# EAGLE design ACT Lipoly Charger R3 FINAL (EAGLE 8.2.2)
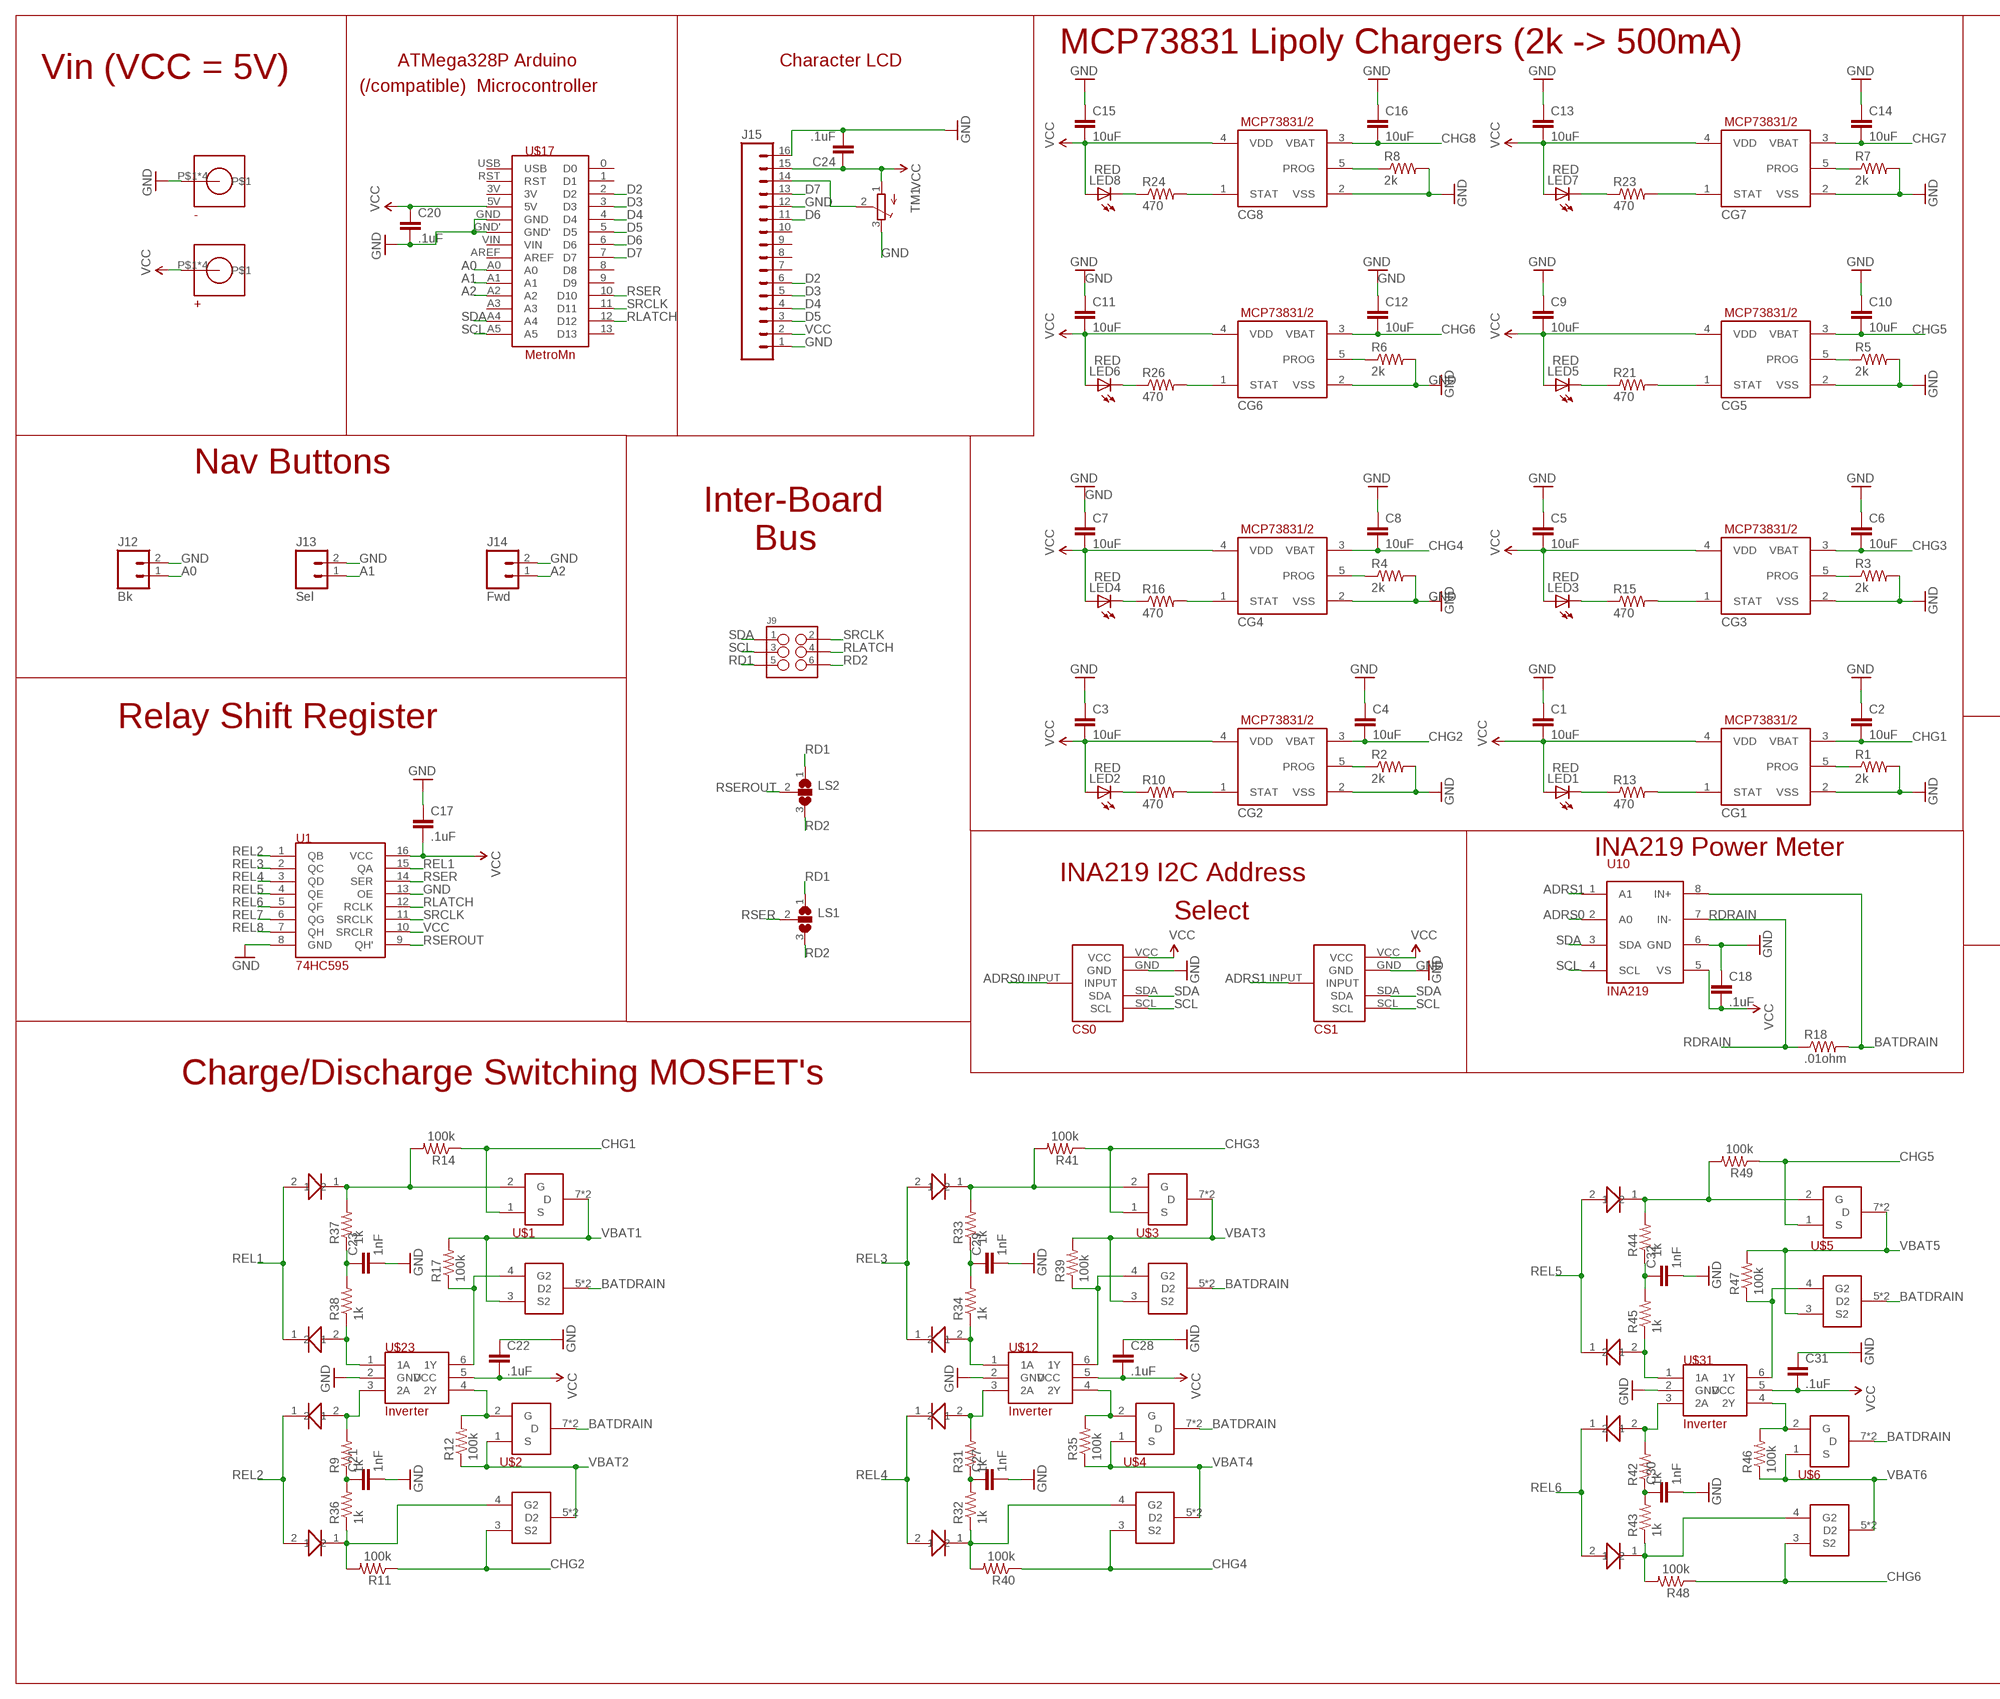
[diagram p0: schematic, sheet 1, part 1 of 2]
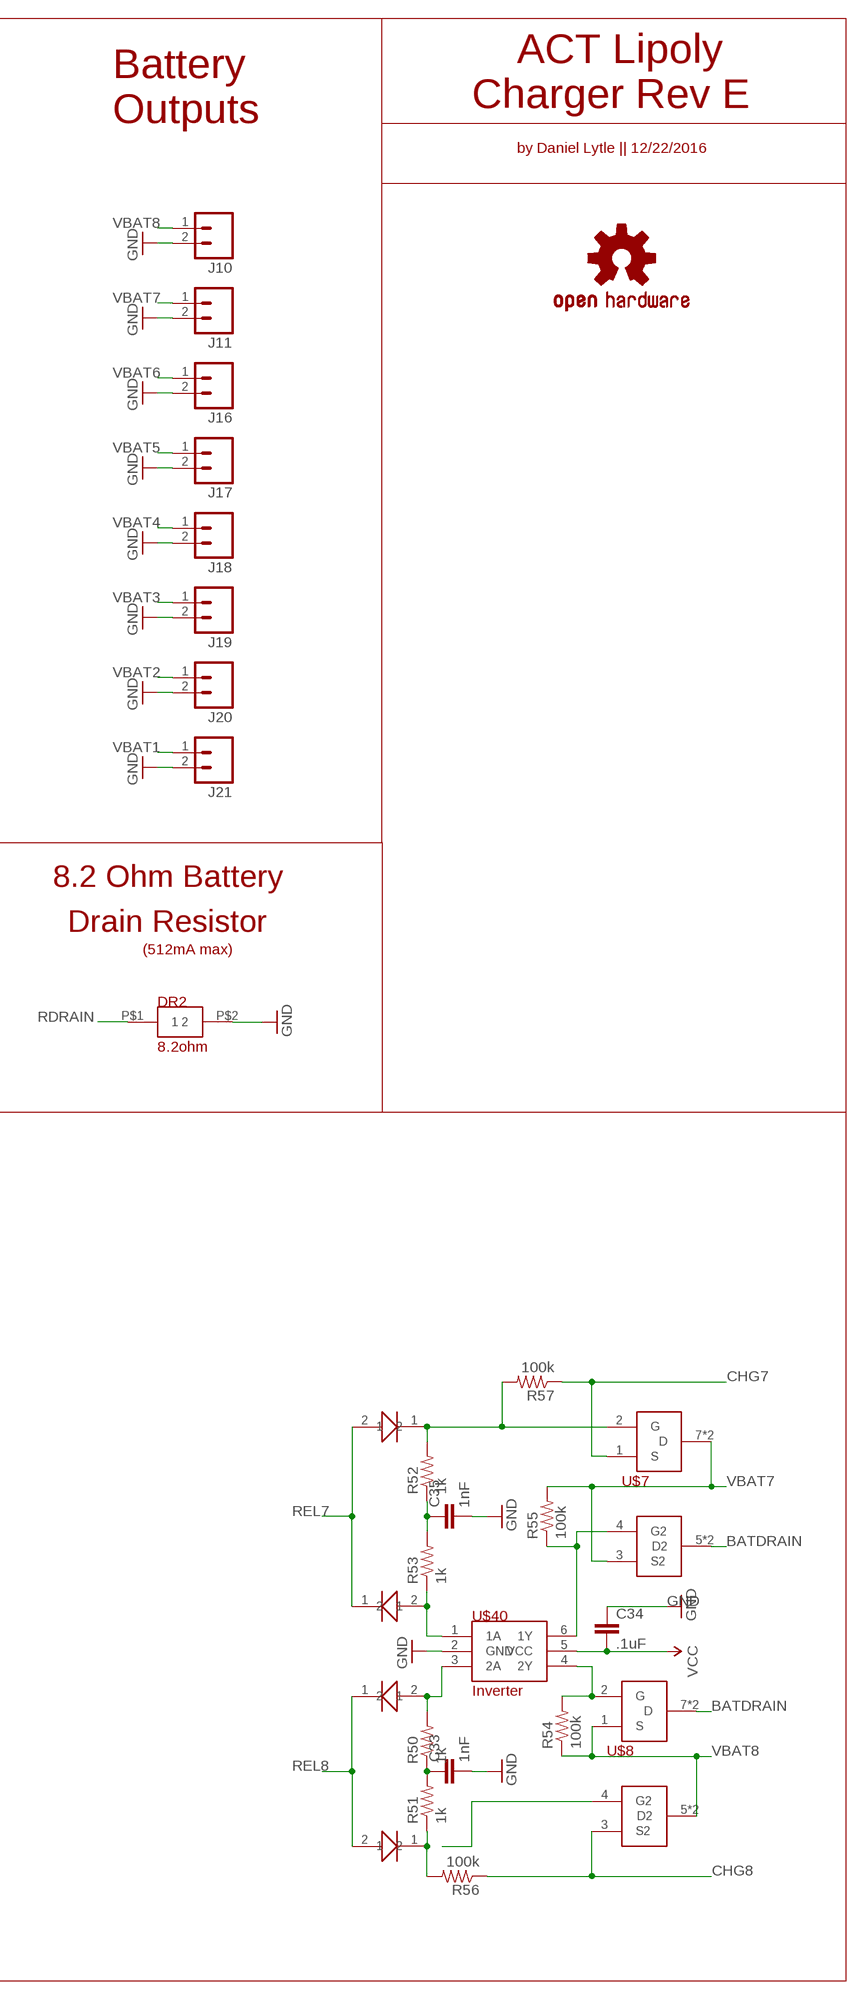
[diagram p1: schematic, sheet 1, part 2 of 2]

## Parts
+  8191-SEMS  [9191-SEMS]
-  8191-SEMS  [9191-SEMS]
C1  10uF  CAP0805  [0805]
C2  10uF  CAP0805  [0805]
C3  10uF  CAP0805  [0805]
C4  10uF  CAP0805  [0805]
C5  10uF  CAP0805  [0805]
C6  10uF  CAP0805  [0805]
C7  10uF  CAP0805  [0805]
C8  10uF  CAP0805  [0805]
C9  10uF  CAP0805  [0805]
C10  10uF  CAP0805  [0805]
C11  10uF  CAP0805  [0805]
C12  10uF  CAP0805  [0805]
C13  10uF  CAP0805  [0805]
C14  10uF  CAP0805  [0805]
C15  10uF  CAP0805  [0805]
C16  10uF  CAP0805  [0805]
C17  .1uF  CAP0805  [0805]
C18  .1uF  CAP0805  [0805]
C20  .1uF  CAP0805  [0805]
C21  1nF  CAP0805  [0805]
C22  .1uF  CAP0805  [0805]
C23  1nF  CAP0805  [0805]
C24  .1uF  CAP0805  [0805]
C27  1nF  CAP0805  [0805]
C28  .1uF  CAP0805  [0805]
C29  1nF  CAP0805  [0805]
C30  1nF  CAP0805  [0805]
C31  .1uF  CAP0805  [0805]
C32  1nF  CAP0805  [0805]
C33  1nF  CAP0805  [0805]
C34  .1uF  CAP0805  [0805]
C35  1nF  CAP0805  [0805]
CG1  MCP73831/OT  [SOT23-5L]
CG2  MCP73831/OT  [SOT23-5L]
CG3  MCP73831/OT  [SOT23-5L]
CG4  MCP73831/OT  [SOT23-5L]
CG5  MCP73831/OT  [SOT23-5L]
CG6  MCP73831/OT  [SOT23-5L]
CG7  MCP73831/OT  [SOT23-5L]
CG8  MCP73831/OT  [SOT23-5L]
CS0  4-WAYSELECTOR  [4-WAYSELECTOR]
CS1  4-WAYSELECTOR  [4-WAYSELECTOR]
DR2  8.2ohm  UB5C-5R6F1  [UB5C-5R6F1]
J9  M03X2FEMALE  [2X3]
J10  M02LOCK_LONGPADS  [1X02_LOCK_LONGPADS]
J11  M02LOCK_LONGPADS  [1X02_LOCK_LONGPADS]
J12  Bk  M02LOCK_LONGPADS  [1X02_LOCK_LONGPADS]
J13  Sel  M02LOCK_LONGPADS  [1X02_LOCK_LONGPADS]
J14  Fwd  M02LOCK_LONGPADS  [1X02_LOCK_LONGPADS]
J15  M16LOCK_LONGPADS  [1X16_LOCK_LONGPADS]
J16  M02LOCK_LONGPADS  [1X02_LOCK_LONGPADS]
J17  M02LOCK_LONGPADS  [1X02_LOCK_LONGPADS]
J18  M02LOCK_LONGPADS  [1X02_LOCK_LONGPADS]
J19  M02LOCK_LONGPADS  [1X02_LOCK_LONGPADS]
J20  M02LOCK_LONGPADS  [1X02_LOCK_LONGPADS]
J21  M02LOCK_LONGPADS  [1X02_LOCK_LONGPADS]
LED1  RED  LEDCHIP-LED0805  [CHIP-LED0805]
LED2  RED  LEDCHIP-LED0805  [CHIP-LED0805]
LED3  RED  LEDCHIP-LED0805  [CHIP-LED0805]
LED4  RED  LEDCHIP-LED0805  [CHIP-LED0805]
LED5  RED  LEDCHIP-LED0805  [CHIP-LED0805]
LED6  RED  LEDCHIP-LED0805  [CHIP-LED0805]
LED7  RED  LEDCHIP-LED0805  [CHIP-LED0805]
LED8  RED  LEDCHIP-LED0805  [CHIP-LED0805]
LS1  SJ2W  [SJ_2]
LS2  SJ2W  [SJ_2]
R1  2k  RESISTOR0805-RES  [0805]
R2  2k  RESISTOR0805-RES  [0805]
R3  2k  RESISTOR0805-RES  [0805]
R4  2k  RESISTOR0805-RES  [0805]
R5  2k  RESISTOR0805-RES  [0805]
R6  2k  RESISTOR0805-RES  [0805]
R7  2k  RESISTOR0805-RES  [0805]
R8  2k  RESISTOR0805-RES  [0805]
R9  1k  RESISTOR0805-RES  [0805]
R10  470  RESISTOR0805-RES  [0805]
R11  100k  RESISTOR0805-RES  [0805]
R12  100k  RESISTOR0805-RES  [0805]
R13  470  RESISTOR0805-RES  [0805]
R14  100k  RESISTOR0805-RES  [0805]
R15  470  RESISTOR0805-RES  [0805]
R16  470  RESISTOR0805-RES  [0805]
R17  100k  RESISTOR0805-RES  [0805]
R18  .01ohm  RESISTOR0805-RES  [0805]
R21  470  RESISTOR0805-RES  [0805]
R23  470  RESISTOR0805-RES  [0805]
R24  470  RESISTOR0805-RES  [0805]
R26  470  RESISTOR0805-RES  [0805]
R31  1k  RESISTOR0805-RES  [0805]
R32  1k  RESISTOR0805-RES  [0805]
R33  1k  RESISTOR0805-RES  [0805]
R34  1k  RESISTOR0805-RES  [0805]
R35  100k  RESISTOR0805-RES  [0805]
R36  1k  RESISTOR0805-RES  [0805]
R37  1k  RESISTOR0805-RES  [0805]
R38  1k  RESISTOR0805-RES  [0805]
R39  100k  RESISTOR0805-RES  [0805]
R40  100k  RESISTOR0805-RES  [0805]
R41  100k  RESISTOR0805-RES  [0805]
R42  1k  RESISTOR0805-RES  [0805]
R43  1k  RESISTOR0805-RES  [0805]
R44  1k  RESISTOR0805-RES  [0805]
R45  1k  RESISTOR0805-RES  [0805]
R46  100k  RESISTOR0805-RES  [0805]
R47  100k  RESISTOR0805-RES  [0805]
R48  100k  RESISTOR0805-RES  [0805]
R49  100k  RESISTOR0805-RES  [0805]
R50  1k  RESISTOR0805-RES  [0805]
R51  1k  RESISTOR0805-RES  [0805]
R52  1k  RESISTOR0805-RES  [0805]
R53  1k  RESISTOR0805-RES  [0805]
R54  100k  RESISTOR0805-RES  [0805]
R55  100k  RESISTOR0805-RES  [0805]
R56  100k  RESISTOR0805-RES  [0805]
R57  100k  RESISTOR0805-RES  [0805]
TM1  TRIMPOTTC33X  [TC33X]
U1  74HC595  [DIL16]
U10  INA219  [SOIC8]
U$1  DMP3085LSD  [SOIC8]
U$2  DMP3085LSD  [SOIC8]
U$3  DMP3085LSD  [SOIC8]
U$4  DMP3085LSD  [SOIC8]
U$5  DMP3085LSD  [SOIC8]
U$6  DMP3085LSD  [SOIC8]
U$7  DMP3085LSD  [SOIC8]
U$8  DMP3085LSD  [SOIC8]
U$12  Inverter  TC7PZ14FU,LJ(CT_INVERTER  [SOT363_PHILIPS]
U$15  DA2J10100L_DIODE  [SOD323]
U$16  DA2J10100L_DIODE  [SOD323]
U$17  MetroMn  ADAFRUIT_METRO_MINI  [ADAFRUIT_METRO_MINI]
U$18  DA2J10100L_DIODE  [SOD323]
U$19  DA2J10100L_DIODE  [SOD323]
U$23  Inverter  TC7PZ14FU,LJ(CT_INVERTER  [SOT363_PHILIPS]
U$26  DA2J10100L_DIODE  [SOD323]
U$27  DA2J10100L_DIODE  [SOD323]
U$28  DA2J10100L_DIODE  [SOD323]
U$29  DA2J10100L_DIODE  [SOD323]
U$31  Inverter  TC7PZ14FU,LJ(CT_INVERTER  [SOT363_PHILIPS]
U$34  DA2J10100L_DIODE  [SOD323]
U$35  DA2J10100L_DIODE  [SOD323]
U$36  DA2J10100L_DIODE  [SOD323]
U$37  DA2J10100L_DIODE  [SOD323]
U$40  Inverter  TC7PZ14FU,LJ(CT_INVERTER  [SOT363_PHILIPS]
U$43  DA2J10100L_DIODE  [SOD323]
U$44  DA2J10100L_DIODE  [SOD323]
U$45  DA2J10100L_DIODE  [SOD323]
U$46  DA2J10100L_DIODE  [SOD323]
VCC  OSHW-LOGOM-COPPER  [OSHW-LOGO-M_COPPER]

## Nets
A0: J12.1 U$17.A0
A1: J13.1 U$17.A1
A2: J14.1 U$17.A2
ADRS0: CS0.INPUT U10.2(A0)
ADRS1: CS1.INPUT U10.1(A1)
BATDRAIN: R18.2 U10.8(IN+) U$1.5(D2) U$1.6(D2) U$2.7(D) U$2.8(D) U$3.5(D2) U$3.6(D2) U$4.7(D) U$4.8(D) U$5.5(D2) U$5.6(D2) U$6.7(D) U$6.8(D) U$7.5(D2) U$7.6(D2) U$8.7(D) U$8.8(D)
CHG1: C2.2 CG1.3(VBAT) R14.1 U$1.1(S)
CHG2: C4.2 CG2.3(VBAT) R11.1 U$2.3(S2)
CHG3: C6.2 CG3.3(VBAT) R41.1 U$3.1(S)
CHG4: C8.2 CG4.3(VBAT) R40.1 U$4.3(S2)
CHG5: C10.2 CG5.3(VBAT) R49.1 U$5.1(S)
CHG6: C12.2 CG6.3(VBAT) R48.1 U$6.3(S2)
CHG7: C14.2 CG7.3(VBAT) R57.1 U$7.1(S)
CHG8: C16.2 CG8.3(VBAT) R56.1 U$8.3(S2)
D2: J15.6 U$17.2(D2)
D3: J15.5 U$17.3(D3)
D4: J15.4 U$17.4(D4)
D5: J15.3 U$17.5(D5)
D6: J15.11 U$17.6(D6)
D7: J15.13 U$17.7(D7)
GND: -.P$1 -.P$2 -.P$3 -.P$4 C1.1 C2.1 C3.1 C4.1 C5.1 C6.1 C7.1 C8.1 C9.1 C10.1 C11.1 C12.1 C13.1 C14.1 C15.1 C16.1 C17.1 C18.1 C20.2 C21.2 C22.1 C23.2 C24.2 C27.2 C28.1 C29.2 C30.2 C31.1 C32.2 C33.2 C34.1 C35.2 CG1.2(VSS) CG2.2(VSS) CG3.2(VSS) CG4.2(VSS) CG5.2(VSS) CG6.2(VSS) CG7.2(VSS) CG8.2(VSS) CS0.GND CS1.GND DR2.P$2 J10.2 J11.2 J12.2 J13.2 J14.2 J15.1 J15.12 J15.16 J16.2 J17.2 J18.2 J19.2 J20.2 J21.2 R1.2 R2.2 R3.2 R4.2 R5.2 R6.2 R7.2 R8.2 TM1.3(E) U1.8(GND) U1.13(OE) U10.6(GND) U$12.2(GND) U$17.GND U$17.GND' U$23.2(GND) U$31.2(GND) U$40.2(GND)
N$1: CG7.1(STAT) R23.2
N$2: CG8.5(PROG) R8.1
N$3: LED7.C R23.1
N$4: CG7.5(PROG) R7.1
N$5: CG6.5(PROG) R6.1
N$6: CG8.1(STAT) R24.2
N$7: CG5.5(PROG) R5.1
N$8: CG4.5(PROG) R4.1
N$9: LED8.C R24.1
N$10: CG3.5(PROG) R3.1
N$11: CG2.5(PROG) R2.1
N$12: LED6.C R26.1
N$13: CG1.5(PROG) R1.1
N$14: CG6.1(STAT) R26.2
N$15: CG4.1(STAT) R16.2
N$16: LED4.C R16.1
N$17: LED5.C R21.1
N$18: CG5.1(STAT) R21.2
N$19: LED3.C R15.1
N$20: CG3.1(STAT) R15.2
N$21: LED1.C R13.1
N$22: CG1.1(STAT) R13.2
N$23: CG2.1(STAT) R10.2
N$24: LED2.C R10.1
N$25: U$8.4(G2)
N$28: J15.14 TM1.2(S)
N$36: R38.1 U$23.1(1A) U$29.2
N$37: R9.2 U$23.3(2A) U$28.2
N$38: C21.1 R9.1 R36.2
N$39: R11.2 R36.1 U$2.4(G2) U$26.1
N$40: R12.2 U$2.2(G) U$23.4(2Y)
N$41: R17.1 U$1.4(G2) U$23.6(1Y)
N$42: C23.1 R37.1 R38.2
N$43: R14.2 R37.2 U$1.2(G) U$27.1
N$44: R31.2 U$12.3(2A) U$16.2
N$45: C27.1 R31.1 R32.2
N$46: R32.1 R40.2 U$4.4(G2) U$15.1
N$47: R35.2 U$4.2(G) U$12.4(2Y)
N$50: R34.1 U$12.1(1A) U$19.2
N$51: R39.1 U$3.4(G2) U$12.6(1Y)
N$52: R33.2 R41.2 U$3.2(G) U$18.1
N$54: C29.1 R33.1 R34.2
N$55: R42.2 U$31.3(2A) U$35.2
N$56: C30.1 R42.1 R43.2
N$57: R43.1 R48.2 U$6.4(G2) U$34.1
N$58: R46.2 U$6.2(G) U$31.4(2Y)
N$59: R45.1 U$31.1(1A) U$37.2
N$60: R47.1 U$5.4(G2) U$31.6(1Y)
N$61: R44.2 R49.2 U$5.2(G) U$36.1
N$62: C32.1 R44.1 R45.2
N$63: R50.2 U$40.3(2A) U$44.2
N$64: C33.1 R50.1 R51.2
N$65: R51.1 R56.2 U$43.1
N$66: R54.2 U$8.2(G) U$40.4(2Y)
N$67: R53.1 U$40.1(1A) U$46.2
N$68: R55.1 U$7.4(G2) U$40.6(1Y)
N$69: R52.2 R57.2 U$7.2(G) U$45.1
N$70: C35.1 R52.1 R53.2
RD1: J9.5 LS1.1 LS2.1
RD2: J9.6 LS1.3 LS2.3
RDRAIN: DR2.P$1 R18.1 U10.7(IN-)
REL1: U1.15(QA) U$27.2 U$29.1
REL2: U1.1(QB) U$26.2 U$28.1
REL3: U1.2(QC) U$18.2 U$19.1
REL4: U1.3(QD) U$15.2 U$16.1
REL5: U1.4(QE) U$36.2 U$37.1
REL6: U1.5(QF) U$34.2 U$35.1
REL7: U1.6(QG) U$45.2 U$46.1
REL8: U1.7(QH) U$43.2 U$44.1
RLATCH: J9.4 U1.12(RCLK) U$17.12(D12)
RSER: LS1.2 U1.14(SER) U$17.10(D10)
RSEROUT: LS2.2 U1.9(QH')
SCL: CS0.SCL CS1.SCL J9.3 U10.4(SCL) U$17.A5
SDA: CS0.SDA CS1.SDA J9.1 U10.3(SDA) U$17.A4
SRCLK: J9.2 U1.11(SRCLK) U$17.11(D11)
VBAT1: J21.1 R17.2 U$1.3(S2) U$1.7(D) U$1.8(D)
VBAT2: J20.1 R12.1 U$2.1(S) U$2.5(D2) U$2.6(D2)
VBAT3: J19.1 R39.2 U$3.3(S2) U$3.7(D) U$3.8(D)
VBAT4: J18.1 R35.1 U$4.1(S) U$4.5(D2) U$4.6(D2)
VBAT5: J17.1 R47.2 U$5.3(S2) U$5.7(D) U$5.8(D)
VBAT6: J16.1 R46.1 U$6.1(S) U$6.5(D2) U$6.6(D2)
VBAT7: J11.1 R55.2 U$7.3(S2) U$7.7(D) U$7.8(D)
VBAT8: J10.1 R54.1 U$8.1(S) U$8.5(D2) U$8.6(D2)
VCC: +.P$1 +.P$2 +.P$3 +.P$4 C1.2 C3.2 C5.2 C7.2 C9.2 C11.2 C13.2 C15.2 C17.2 C18.2 C20.1 C22.2 C24.1 C28.2 C31.2 C34.2 CG1.4(VDD) CG2.4(VDD) CG3.4(VDD) CG4.4(VDD) CG5.4(VDD) CG6.4(VDD) CG7.4(VDD) CG8.4(VDD) CS0.VCC CS1.VCC J15.2 J15.15 LED1.A LED2.A LED3.A LED4.A LED5.A LED6.A LED7.A LED8.A TM1.1(A) U1.10(SRCLR) U1.16(VCC) U10.5(VS) U$12.5(VCC) U$17.5V U$23.5(VCC) U$31.5(VCC) U$40.5(VCC)
Unconnected: J15.7 J15.8 J15.9 J15.10 U$17.0(D0) U$17.1(D1) U$17.3V U$17.8(D8) U$17.9(D9) U$17.13(D13) U$17.A3 U$17.AREF U$17.RST U$17.USB U$17.VIN

## Notes on the sheet
- MCP73831 Lipoly Chargers (2k -> 500mA) | ACT Lipoly
- ATMega328P Arduino | Character LCD | Battery
- Vin (VCC = 5V)
- (/compatible)  Microcontroller | Charger Rev E
- Outputs
- by Daniel Lytle || 12/22/2016
- Nav Buttons
- Inter-Board
- Bus
- Relay Shift Register
- 8.2 Ohm Battery
- Drain Resistor
- (512mA max)
- INA219 Power Meter
- INA219 I2C Address
- Select
- Charge/Discharge Switching MOSFET's

## Library data of the parts
+ - = ACT ChargerProblem:8191-SEMS: 8191-SEMS screw terminal
C1-C18 C20 C22 C24 C28 C31 C34 = SparkFun-Capacitors:CAP: Capacitor Standard 0603 ceramic capacitor, and 0.1" leaded capacitor.
C21 C23 C27 C29 C30 C32 C33 C35 = SparkFun-Passives:CAP: Capacitor Standard 0603 ceramic capacitor, and 0.1" leaded capacitor.
CG1-CG8 = adafruit:MCP73831: MCP73831/2 Miniature Single-Cell, Fully Integrated Li-Ion, Li-Polymer Charge Management Controllers. Nice and small simple lipoly charge controller, with adjustable current and status output (LED) http://www.ladyada.net/library/pcb/eaglelibrary.html
CS0 CS1 = ACT ChargerProblem:4-WAYSELECTOR: 4-way solder jumer selector for i2c address assignment with INA219 power monitor IC
DR2 = ACT ChargerProblem:UB5C-5R6F1: UB5C-5R6F1 5ohm 5W axial resistor
J9 = SparkFun-Connectors:M03X2: 2x3 .1" header. Shrouded, with keying- CONN-10681 SMT- CONN-11415 Pogo pins- HW-11044; PROD_ID: CONN-11566; VALUE: FEMALE 2x3
J10-J14 J16-J21 = SparkFun-Connectors:M02: Standard 2-pin 0.1" header. Use with - straight break away headers ( PRT-00116) - right angle break away headers (PRT-00553) - swiss pins (PRT-00743) - machine pins (PRT-00117) - female headers (PRT-00115) Molex polarized connector foot print use with: PRT-08233 with associated crimp pins and housings. 2.54_SCREWTERM for use with PRT-10571. 3.5mm Screw Terminal footprints for PRT-08084 5mm Screw Terminal footprints for use with PRT-08432
J15 = SparkFun-Connectors:M16: 1x16 .1" header
LED1-LED8 = adafruit:LED: LED OSRAM: - CHIPLED LG R971, LG N971, LY N971, LG Q971, LY Q971, LO R971, LY R971 LH N974, LH R974 LS Q976, LO Q976, LY Q976 LO Q996 - Hyper CHIPLED LW Q18S LB Q993, LB Q99A, LB R99A - SideLED LS A670, LO A670, LY A670, LG A670, LP A670 LB A673, LV A673, LT A673, LW A673 LH A674 LY A675 LS A676, LA A676, LO A676, LY A676, LW A676 LS A679, LY A679, LG A679 - Hyper Micro SIDELED® LS Y876, LA Y876, LO Y876, LY Y876 LT Y87S - SmartLED LW L88C, LW L88S LB L89C, LB L89S, LG L890 LS L89K, LO L89K, LY L89K LS L896, LA L896, LO L896, LY L896 - TOPLED LS T670, LO T670, LY T670, LG T670, LP T670 LSG T670, LSP T670, LSY T670, LOP T670, LYG T670 LG T671, LOG T671, LSG T671 LB T673, LV T673, LT T673, LW T673 LH T674 LS T676, LA T676, LO T676, LY T676, LB T676, LH T676, LSB T676, LW T676 LB T67C, LV T67C, LT T67C, LS T67K, LO T67K, LY T67K, LW E67C LS E67B, LA E67B, LO E67B, LY E67B, LB E67C, LV E67C, LT E67C LW T67C LS T679, LY T679, LG T679 LS T770, LO T770, LY T770, LG T770, LP T770 LB T773, LV T773, LT T773, LW T773 LH T774 LS E675, LA E675, LY E675, LS T675 LS T776, LA T776, LO T776, LY T776, LB T776 LHGB T686 LT T68C, LB T68C - Hyper Mini TOPLED® LB M676 - Mini TOPLED Santana® LG M470 LS M47K, LO M47K, LY M47K Source: http://www.osram.convergy.de/
LS1 LS2 = ACT ChargerProblem:SJ2W: SMD solder JUMPER
R1-R8 R10-R18 R21 R23 R24 R26 R35 R39-R41 R46-R49 R54-R57 = SparkFun-Passives:RESISTOR: Resistor Basic schematic elements and footprints for 0603, 1206, and PTH resistors.
R9 R31-R34 R36-R38 R42-R45 R50-R53 = SparkFun-Resistors:RESISTOR: Resistor Basic schematic elements and footprints for 0603, 1206, and PTH resistors.
TM1 = adafruit:TRIMPOT: SMT trimmer potentiometer part number TC33X http://www.ladyada.net/library/eagle
U1 = ACT ChargerProblem:74HC595: 74hc595 8-bit shift register
U10 = ACT Charger:INA219
U$1-U$8 = ACT ChargerProblem:DMP3085LSD: MOSFET 2P-CH 30V 3.9A 8SO
U$12 U$23 U$31 U$40 = ACT ChargerProblem:TC7PZ14FU,LJ(CT_INVERTER: Inverter IC 2 Channel Schmitt Trigger US6
U$15 U$16 U$18 U$19 U$26-U$29 U$34-U$37 U$43-U$46 = ACT ChargerProblem:DA2J10100L_DIODE: Diode Standard 80V 100mA DC Surface Mount SMini2-F5-B
U$17 = ACT ChargerProblem:ADAFRUIT_METRO_MINI: Adafruit Metro Mini w/ ATmega328 & SiLabs CP2104 usb-to-serial converter
VCC = SparkFun-Aesthetics:OSHW-LOGO: Open Source Hardware Logo This logo indicates the piece of hardware it is found on incorporates a OSHW license and/or adheres to the definition of open source hardware found here: http://freedomdefined.org/OSHW

## Board
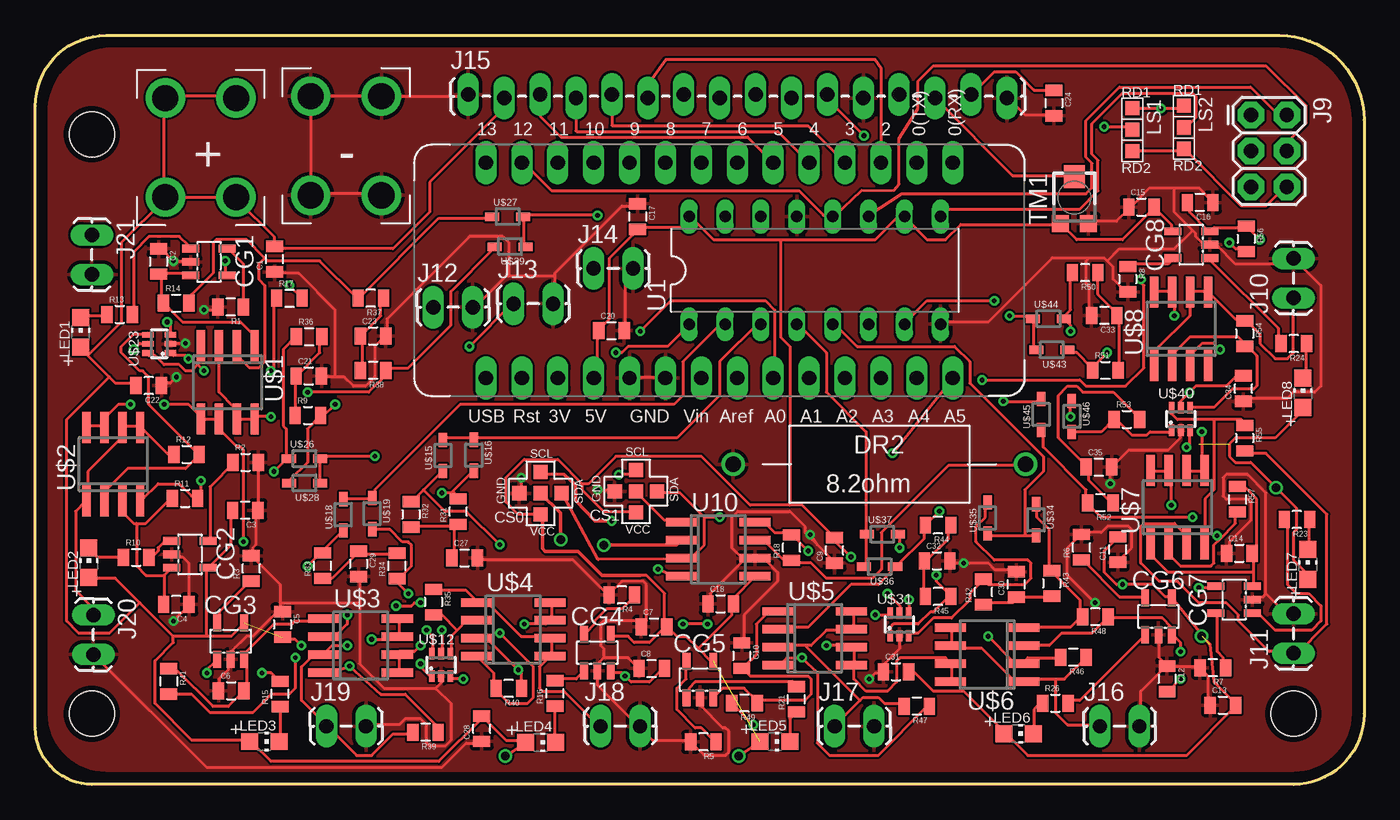
[diagram p2: board, top side]
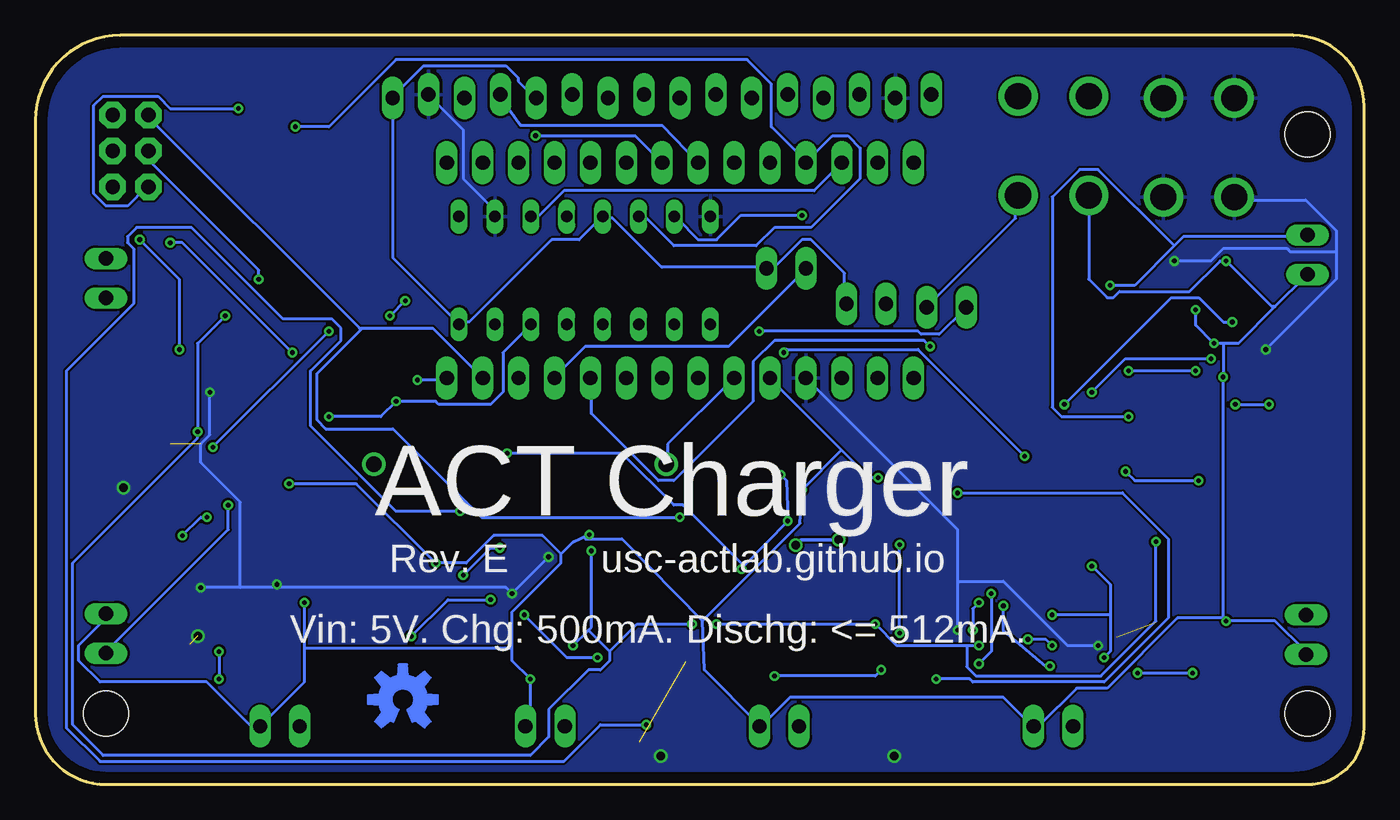
[diagram p3: board, bottom side, seen from below]

Size 94 x 53 mm. Coordinates in mm from the lower left corner, seen from the top.
Outline: 0,48 arc-90 5,53 88,53 arc-90 94,47 94,5 arc-90 89,0 4,0 arc-90 0,4 0,48
Copper layers (1*16): Top 0.0356mm / dielectric 1.5011mm / Bottom 0.0356mm
Design rules "LaenPCBOrder (1)": minimum track width 6mil, minimum drill 13mil, track to track 6mil, track to pad 6mil, pad to pad 6mil, via to via 6mil, smd to smd 6mil, copper to edge 15mil, drill to drill 6mil, minimum pad ring 7mil, minimum via ring 7mil, stop-mask expansion 3mil, vias tented up to drill 0mil, thermal gap 10mil
Holes 3.2 mm at 89,5 4,5 4,46

### Footprints (pad centres in the part's own frame; a part is rotated, then mirrored left to right if it is on the bottom)
9191-SEMS = drill 1.85: P$1 0,0; P$2 0,-7.01; P$3 5,-7.01; P$4 5,0
0805 = smd 0.8 x 1.2: 1 -0.9,0; 2 0.9,0
SOT23-5L = smd 0.55 x 1.2: 1 -0.95,-1.3; 2 0,-1.3; 3 0.95,-1.3; 4 0.95,1.3; 5 -0.95,1.3
4-WAYSELECTOR = smd 1 x 1: GND -1.5,0; INPUT 0,0; SCL 0,1.5; SDA 1.5,0; VCC 0,-1.5
UB5C-5R6F1 = drill 1.1: P$1 -10.35,0; P$2 10.35,0
2X3 = drill 1.016 pad 1.88 octagon: 1 0,0; 2 0,2.54; 3 2.54,0; 4 2.54,2.54; 5 5.08,0; 6 5.08,2.54
1X02_LOCK_LONGPADS = drill 1.016 long: 1 -0.127,0; 2 2.667,0
1X16_LOCK_LONGPADS = drill 1.016 long: 1 0,0.127; 2 2.54,-0.127; 3 5.08,0.127; 4 7.62,-0.127; 5 10.16,0.127; 6 12.7,-0.127; 7 15.24,0.127; 8 17.78,-0.127; 9 20.32,0.127; 10 22.86,-0.127; 11 25.4,0.127; 12 27.94,-0.127; 13 30.48,0.127; 14 33.02,-0.127; 15 35.56,0.127; 16 38.1,-0.127
CHIP-LED0805 = smd 1.2 x 1.2: A 0,-1.05; C 0,1.05
SJ_2 = smd 1 x 1: 1 -1.524,0; 2 0,0; 3 1.524,0
TC33X = smd 1.2 x 1.2: 1 -1,-1.825; 3 1,-1.825 | smd 1.5 x 1.6: 2 0,1.5
DIL16 = drill 0.813 long: 1 -8.89,-3.81; 2 -6.35,-3.81; 3 -3.81,-3.81; 4 -1.27,-3.81; 5 1.27,-3.81; 6 3.81,-3.81; 7 6.35,-3.81; 8 8.89,-3.81; 9 8.89,3.81; 10 6.35,3.81; 11 3.81,3.81; 12 1.27,3.81; 13 -1.27,3.81; 14 -3.81,3.81; 15 -6.35,3.81; 16 -8.89,3.81
SOIC8 = smd 0.6 x 2.2: 1 -1.905,-2.6; 2 -0.635,-2.6; 3 0.635,-2.6; 4 1.905,-2.6; 5 1.905,2.6; 6 0.635,2.6; 7 -0.635,2.6; 8 -1.905,2.6
SOT363_PHILIPS = smd 0.4 x 0.8: 1 -0.65,-0.8; 2 0,-0.8; 3 0.65,-0.8; 4 0.65,0.8; 5 0,0.8; 6 -0.65,0.8
SOD323 = smd 1 x 0.6: 1 -1.1,0; 2 1.1,0
ADAFRUIT_METRO_MINI = drill 1.016 long: 0 17.78,7.62; 1 15.24,7.62; 2 12.7,7.62; 3 10.16,7.62; 3V -10.16,-7.62; 4 7.62,7.62; 5 5.08,7.62; 5V -7.62,-7.62; 6 2.54,7.62; 7 0,7.62; 8 -2.54,7.62; 9 -5.08,7.62; 10 -7.62,7.62; 11 -10.16,7.62; 12 -12.7,7.62; 13 -15.24,7.62; A0 5.08,-7.62; A1 7.62,-7.62; A2 10.16,-7.62; A3 12.7,-7.62; A4 15.24,-7.62; A5 17.78,-7.62; AREF 2.54,-7.62; GND -5.08,-7.62; GND' -2.54,-7.62; RST -12.7,-7.62; USB -15.24,-7.62; VIN 0,-7.62

### Placement (x,y rotation side)
+  9.2,48.56 0 top
-  19.48,48.69 0 top
C1  16.91,37.16 90 top
C2  8.71,37 270 top
C3  14.85,19.38 180 top
C4  9.97,12.72 180 top
C5  17.48,11.32 270 top
C6  13.86,6.63 0 top
C7  43.76,11.13 0 top
C8  43.6,8.19 0 top
C9  56.54,16.56 90 top
C10  49.97,9.11 270 top
C11  76.56,16.61 90 top
C12  80.06,7.47 270 top
C13  84.01,5.61 0 top
C14  85.16,16.35 0 top
C15  78.25,40.85 0 top
C16  82.39,41.17 180 top
C17  42.61,40.18 270 top
C18  48.48,12.77 0 top
C20  40.75,32.1 0 top
C21  19.34,28.9 0 top
C22  8.03,28.21 180 top
C23  23.89,31.73 0 top
C24  72.05,48.21 270 top
C27  30.37,16.02 0 top
C28  31.57,3.94 90 top
C29  22.86,15.6 270 top
C30  69.39,14.14 90 top
C31  60.89,7.98 0 top
C32  63.79,15.82 0 top
C33  75.61,33.17 180 top
C34  85.45,28.01 90 top
C35  75.24,22.45 0 top
CG1  12.28,36.97 270 top
CG2  10.94,16.28 270 top
CG3  13.82,10.13 0 top
CG4  39.76,9.32 0 top
CG5  47.01,7.41 0 top
CG6  79.45,11.88 0 top
CG7  84.8,13.07 90 top
CG8  81.77,38.19 90 top
CS0  35.73,20.6 0 top
CS1  42.49,20.74 0 top
DR2  59.71,22.65 180 top
J9  85.99,47.37 270 top
J10  89,34.55 90 top
J11  89,9.4 90 top
J12  28.28,33.76 0 top
J13  33.95,34.01 0 top
J14  39.61,36.5 0 top
J15  30.63,48.69 0 top
J16  75.43,4.11 0 top
J17  56.66,4.11 0 top
J18  40.1,4.11 0 top
J19  20.72,4.11 0 top
J20  4.1,11.86 270 top
J21  4,38.75 270 top
LED1  3.2,31.98 0 top
LED2  3.79,15.68 0 top
LED3  16.21,3.03 270 top
LED4  35.74,2.97 270 top
LED5  52.32,3.03 270 top
LED6  69.55,3.59 270 top
LED7  90.02,15.56 0 top
LED8  89.67,27.71 0 top
LS1  77.61,46.32 270 top
LS2  81.25,46.49 270 top
R1  13.81,33.78 180 top
R2  14.87,22.79 0 top
R3  15.28,15.28 90 top
R4  41.49,13.4 180 top
R5  47.25,3 180 top
R6  74.01,16.78 90 top
R7  83.29,8.26 180 top
R8  77.28,35.74 270 top
R9  19.28,26.1 0 top
R10  7.14,16.06 0 top
R11  10.59,20.23 0 top
R12  10.7,23.35 0 top
R13  5.98,33.26 0 top
R14  9.95,34.05 0 top
R15  17.3,6.39 90 top
R16  36.75,6.44 90 top
R17  17.98,34.4 0 top
R18  53.49,16.75 90 top
R21  53.84,6.03 90 top
R23  89.25,18.73 180 top
R24  89.02,31.18 180 top
R26  72.15,5.75 0 top
R31  29.91,19.3 90 top
R32  26.58,19.1 270 top
R33  20.32,15.47 90 top
R34  25.58,15.45 90 top
R35  28.17,12.9 270 top
R36  19.37,31.68 0 top
R37  23.73,34.4 180 top
R38  23.9,29.29 180 top
R39  27.59,3.7 180 top
R40  33.49,6.78 180 top
R41  9.44,7.3 270 top
R42  67.07,13.61 90 top
R43  71.9,14.23 270 top
R44  63.86,18.34 180 top
R45  63.86,13.29 180 top
R46  73.44,9 180 top
R47  62.35,5.54 180 top
R48  74.98,11.85 180 top
R49  50.16,5.75 180 top
R50  74.26,36.21 180 top
R51  75.7,29.3 0 top
R52  75.35,19.92 180 top
R53  77.21,25.83 0 top
R54  85.54,31.89 270 top
R55  85.55,24.5 270 top
R56  85.65,38.6 270 top
R57  85.03,20.17 270 top
TM1  73.5,41.5 0 top
U1  55.14,36.37 0 top
U10  48.31,16.63 270 top
U$1  13.61,28.46 180 top
U$2  5.51,22.66 0 top
U$3  23.01,9.83 270 top
U$4  33.8,10.97 270 top
U$5  55.14,10.34 270 top
U$6  67.32,9.19 90 top
U$7  80.79,19.61 0 top
U$8  81.05,32.23 0 top
U$12  28.7,8.45 0 top
U$15  28.84,23.27 90 top
U$16  31.02,23.29 270 top
U$17  47.11,36.37 0 top
U$18  21.78,19.08 90 top
U$19  23.83,19.16 270 top
U$23  8.76,31.17 90 top
U$26  19.04,23.05 0 top
U$27  33.41,40.17 0 top
U$28  19.04,21.32 180 top
U$29  33.57,38.05 180 top
U$31  61.13,11.31 0 top
U$34  70.78,18.72 270 top
U$35  67.35,18.85 90 top
U$36  59.72,15.4 180 top
U$37  59.91,17.7 0 top
U$40  81.03,25.85 0 top
U$43  71.9,30.74 180 top
U$44  71.66,32.95 0 top
U$45  71.15,26.18 90 top
U$46  73.32,26.04 270 top
VCC  68,6 0 bottom

### Tracks (layer width: path | path; a pad name or v marks a point on that pad's centre or on a via)
A0  (via drill 0.33)
  Top 0.203: v42.79,32.07 44.95,34.23 51.64,34.23 52.29,33.58 52.29,28.83 U$17.A0
  Bottom 0.203: v42.79,32.07 31.57,32.07 31.35,31.85 30.05,31.85 28.33,33.58 J12.1
A1  (via drill 0.33)
  Top 0.203: v30.7,30.99 33.73,34.01 J13.1
  Bottom 0.203: v30.7,30.99 31.13,31.42 41.71,31.42 43.22,29.91 43.22,27.1 48.84,21.49 49.92,21.49 54.67,26.24 54.67,28.61 U$17.A1
A2
  Bottom 0.203: U$17.A2 57.26,28.83 55.1,30.99 44.95,30.99 39.55,36.38 J14.1
ADRS0  (via drill 0.6)
  Top 0.254: CS0.INPUT 37.15,19.19 v37.15,17.31 | v40.23,16.93 45.37,16.93 U10.2
  Bottom 0.254: v37.15,17.31 39.85,17.31 v40.23,16.93
ADRS1
  Top 0.203: CS1.INPUT 42.58,20.62 44.52,18.68 45.6,18.68 U10.1
BATDRAIN  (via drill 0.33)
  Top 0.203: U$2.8 3.71,25.37 4.79,25.37 U$2.7 5.01,25.37 5.01,26.02 5.87,26.88 v6.74,26.88 | v9.11,26.88 10.84,26.88 11.7,26.02 U$1.5 11.92,25.8 12.78,25.8 U$1.6 13,25.8 13,25.16 14.29,23.86 14.51,23.86 14.73,23.65 v14.73,17.17 | U$3.5 25.74,8.1 25.74,9.18 U$3.6 25.74,9.4 26.82,9.4 v27.25,9.83 | U$4.8 36.53,12.85 36.53,11.77 U$4.7 36.32,11.56 36.1,11.34 v34.59,11.34 | U$7.6 81.44,22.13 82.52,22.13 U$7.5 82.52,22.35 v82.52,24.94 | U$8.8 79.28,34.87 80.36,34.87 U$8.7 80.58,34.66 v80.58,33.15 | U10.8 51,18.47 51.64,18.47 52.29,17.82 53.37,17.82 R18.2 53.59,17.6 v54.67,16.52 | U$6.8 64.81,7.45 64.81,8.53 U$6.7 64.6,8.75 64.38,8.96 61.14,8.96 60.93,8.75 60.93,7.24 60.28,6.59 58.77,6.59 57.91,7.45 57.91,8.32 U$5.5 57.91,8.53 57.91,9.61 U$5.6 57.69,9.83 v55.96,9.83 | v47.54,11.34 v45.81,11.34
  Bottom 0.203: v9.11,26.88 v6.74,26.88 | 28.11,9.83 33.08,9.83 v34.59,11.34 v45.81,11.34 | 28.11,9.83 v27.25,9.83 | v14.73,17.17 14.73,11.56 18.61,7.67 27.46,7.67 28.11,8.32 28.11,9.83 | v80.58,33.15 82.52,31.2 v82.52,24.94 82.52,24.51 91.37,15.66 91.37,4.21 89.21,2.06 58.98,2.06 57.69,3.35 57.69,5.3 54.88,8.1 54.02,8.1 53.37,8.75 53.37,9.4 | v54.67,16.52 54.67,11.12 54.88,10.91 | v55.96,9.83 54.88,10.91 | 54.88,10.91 53.37,9.4 | v47.54,11.34 51.43,11.34 53.37,9.4
CHG1
  Top 0.203: CG1.3 10.84,36.17 8.9,36.17 C2.2 8.9,35.95 8.9,34.23 R14.1 9.11,34.01 10.41,32.71 14.51,32.71 15.37,31.85 15.37,31.2 U$1.1
CHG2
  Top 0.203: 9.11,14.79 9.11,12.85 C4.2 | 9.11,14.79 9.54,15.23 CG2.3 | 7.17,18.47 6.95,18.47 6.3,19.11 6.3,19.98 U$2.3 | 7.17,18.47 7.82,18.47 9.54,20.19 R11.1 | 9.11,14.79 7.82,14.79 7.17,15.44 7.17,18.47
CHG3
  Top 0.203: R41.1 9.54,8.1 9.98,8.1 12.57,5.51 13.65,5.51 14.73,6.59 C6.2 14.94,6.81 14.94,8.75 CG3.3 14.94,8.96 14.94,9.4 16.88,11.34 18.18,11.34 18.4,11.56 20.34,11.56 U$3.1
CHG4  (via drill 0.33)
  Top 0.203: CG4.3 40.85,7.89 41.5,7.89 v41.71,7.67 42.14,7.24 43.44,7.24 44.3,8.1 C8.2 | R40.1 34.37,6.81 34.37,7.89 v34.16,8.1 32,10.26 31.35,10.26 U$4.3
  Bottom 0.203: v41.71,7.67 34.59,7.67 v34.16,8.1
CHG5
  Top 0.203: CG5.3 47.97,6.16 48.62,6.81 50.13,6.81 51,5.94 R49.1 51.21,5.94 54.45,5.94 54.88,6.37 54.88,7.45 54.67,7.67 50.56,7.67 50.13,8.1 C10.2 50.13,8.32 51,9.18 51,11.34 51.86,12.2 52.51,12.2 U$5.1
CHG6  (via drill 0.33)
  Top 0.203: v81.01,7.45 80.14,6.59 C12.2 | v81.01,9.4 81.01,10.04 80.58,10.48 CG6.3 80.36,10.69 80.36,11.12 79.71,11.77 76.04,11.77 R48.1 75.83,11.77 74.75,10.69 72.59,10.69 71.72,9.83 70,9.83 U$6.3
  Bottom 0.203: v81.01,9.4 v81.01,7.45
CHG7
  Top 0.203: 86.19,15.01 86.19,14.15 CG7.3 | 86.19,15.01 86.19,16.3 C14.2 86.19,16.52 86.4,16.74 86.4,20.19 85.54,21.05 85.11,21.05 R57.1 | 86.19,15.01 80.14,15.01 79.06,16.09 79.06,16.95 U$7.1
CHG8  (via drill 0.33)
  Top 0.203: C16.2 81.66,41.13 81.66,40.49 82.95,39.19 CG8.3 83.17,39.19 83.38,39.41 85.54,39.41 R56.1 85.76,39.41 v86.62,38.54 | v83.81,30.77 83.38,31.2 82.52,31.2 81.87,30.55 81.87,29.69 U$8.3
  Bottom 0.203: v83.81,30.77 83.81,35.74 v86.62,38.54
D2
  Top 0.2: J15.6 43.33,49.53 44.6,51.3 59.4,51.3 59.8,50.7 59.8,44.28 U$17.2
D3
  Top 0.2: J15.5 40.79,46.61 40.8,46.6 54.66,46.6 U$17.3
D4
  Top 0.2: J15.4 38.25,46.25 38.3,46.2 52.52,46.2 U$17.4
D5
  Top 0.152: 35.71,47.29 J15.3
  Top 0.2: J15.3 35.71,47.29 37.2,45.8 50.38,45.8 U$17.5
D6  (via drill 0.35)
  Top 0.2: J15.11 56.03,48.47 v58.6,45.9
  Top 0.203: 49.7,44.16 U$17.6 | 55.96,48.69 J15.11
  Bottom 0.2: v58.6,45.9 51.56,45.9 U$17.6
D7
  Bottom 0.2: 59.69,46.63 49.65,46.63 U$17.7
  Bottom 0.203: 59.69,46.63 61.14,48.69 J15.13 | U$17.7 47.33,44.16
GND  (via drill 0.33)
  Top 0.152: 30.61,48.8 J15.1
  Top 0.2: -.P$4 30.5,48.69 30.61,48.8
  Top 0.203: v34.37,21.7 34.37,20.62 CS0.GND | v39.77,20.84 40.85,20.84 CS1.GND | U$17.GND' 44.52,28.83 42.14,28.83 U$17.GND | 40.2,8.96 39.77,8.53 39.77,8.1 CG4.2 39.77,7.89 39.77,7.02 42.58,4.21 J18.2 42.79,4 43.66,3.14 46.25,3.14 R5.2 46.46,2.92 47.33,2.06 48.84,2.06 49.05,2.27 49.05,3.78 48.84,4 48.62,4 47.11,5.51 47.11,5.94 CG5.2 | 40.2,8.96 41.93,8.96 42.58,8.32 C8.1 | C27.2 31.35,15.87 38.04,15.87 40.42,13.5 R4.2 40.63,13.5 41.5,14.36 43.01,14.36 43.22,14.15 43.22,11.56 43.01,11.34 C7.1 42.79,11.34 42.58,11.56 40.2,11.56 39.99,11.34 39.99,9.83 40.2,9.61 40.2,8.96 | 87.05,13.5 87.05,20.62 85.76,21.92 84.25,21.92 84.03,21.7 84.03,20.41 84.25,20.19 85.76,20.19 85.97,19.98 85.97,18.68 84.46,17.17 84.46,16.52 C14.1 | 87.05,13.5 86.84,13.28 86.19,13.28 CG7.2 | 87.05,13.5 88.35,12.2 89,12.2 J11.2 | C12.1 80.14,8.32 82.3,8.32 R7.2 82.52,8.1 82.95,7.67 82.95,5.73 C13.1 | CG6.2 79.5,10.48 79.5,8.96 79.93,8.53 C12.1 | C11.1 76.69,15.87 77.55,16.74 77.55,18.03 77.34,18.25 75.83,18.25 75.39,17.82 74.1,17.82 R6.2 73.88,17.6 73.02,16.74 73.02,14.79 v74.96,12.85 | C12.1 79.93,8.32 78.2,6.59 78.2,4.21 J16.2 | C10.1 50.13,10.04 50.13,11.99 52.51,14.36 52.51,15.01 51.64,15.87 51,15.87 U10.6 | 50.13,15.87 47.76,13.5 47.76,12.85 C18.1 | 50.13,15.87 50.78,15.87 U10.6 | 55.31,16.95 54.45,17.82 54.45,18.25 53.37,19.33 49.7,19.33 49.27,18.9 49.27,16.74 50.13,15.87 | 55.31,16.95 56.39,15.87 C9.1 | 50.13,15.87 U10.6 | U$40.2 81.01,24.94 81.01,24.51 80.14,23.65 77.34,23.65 76.26,22.57 C35.2 76.04,22.35 v76.04,21.27 | C30.2 69.35,15.23 67.84,15.23 67.41,15.66 v65.68,15.66 64.81,15.66 C32.2
  Top 0.203: U$31.2 61.14,10.48 61.14,9.61 60.06,8.53 60.06,8.1 C31.1 59.85,7.89 59.42,7.89 v58.98,7.45 | v54.81,17.67 55.31,16.95 | 28.33,6.81 28.76,7.24 28.76,7.45 U$12.2 | 28.33,6.81 24.66,6.81 22.93,8.53 22.93,12.85 | 22.93,12.85 22.93,14.58 C29.2 | 28.33,6.81 29.41,5.73 29.41,3.14 28.98,2.7 27.9,2.7 27.68,2.92 27.68,4.21 27.25,4.65 26.17,4.65 25.74,4.21 23.58,4.21 J19.2 | C6.1 13,6.81 13,7.45 13.65,8.1 13.65,8.75 CG3.2 13.86,8.96 13.86,9.4 14.94,10.48 15.37,10.48 17.32,12.42 | 17.32,12.85 17.32,14.15 15.37,16.09 R3.2 15.37,16.3 15.37,16.74 15.59,16.95 15.59,19.33 C3.1 15.8,19.54 15.8,22.78 R2.2 | 17.32,12.85 17.32,12.42 | 17.32,12.42 C5.1 | 17.32,12.85 22.93,12.85 | CG1.2 10.84,37.03 v9.76,37.03 8.9,37.9 C2.1 | v10.62,31.2 9.76,31.2 U$23.2 | v9.98,28.83 9.54,28.4 9.11,28.4 C22.1 | v11.92,33.58 12.78,33.58 R1.2 | CG2.2 9.76,16.09 10.41,16.09 10.84,15.66 10.84,12.85 C4.1 10.84,12.64 v9.76,11.56 | C28.1 31.57,2.92 30.49,2.92 28.76,1.19 12.13,1.19 4.15,9.18 J20.2 | TM1.3 74.53,39.84 76.47,39.84 77.34,40.7 C15.1 77.55,40.92 78.85,42.21 80.58,42.21 | 80.58,42.21 82.3,42.21 83.17,41.35 C16.1 | C34.1 85.54,27.32 88.56,27.32 89,27.75 90.51,27.75 90.94,28.18 90.94,35.3 89.21,37.03 J10.2 89,37.03 88.78,36.82 84.89,36.82 83.6,38.11 83.17,38.11 CG8.2 82.95,38.33 82.52,38.33 82.09,38.76 82.09,38.98 81.87,39.19 | 80.58,42.21 80.58,40.49 81.87,39.19 | C24.2 71.94,47.4 70,47.4 68.92,48.48 J15.16 | 74.53,37.25 74.31,37.03 74.31,35.52 74.53,35.3 74.53,33.36 C33.2 | 74.53,37.25 75.61,37.25 75.83,37.03 | 75.83,37.03 76.26,36.6 76.26,35.74 77.12,34.87 R8.2 | 74.53,37.25 71.94,37.25 67.41,32.71 64.17,32.71 U1.8
  Top 0.203: 81.87,39.19 80.58,37.9 76.69,37.9 75.83,37.03 | -.P$3 24.44,41.78 19.69,41.78 -.P$2 19.48,41.78 19.48,48.48 -.P$1 19.69,48.69 24.44,48.69 -.P$4 | C20.2 41.71,32.28 41.71,35.95 42.14,36.38 J14.2 | 21.2,28.83 21.85,28.83 22.5,28.18 23.36,28.18 24.01,28.83 24.01,30.99 24.66,31.63 C23.2 24.87,31.85 24.87,32.93 30.7,38.76 33.08,38.76 33.51,38.33 33.51,35.95 | 21.2,28.83 20.34,28.83 C21.2 | 21.2,28.83 21.2,33.58 18.61,36.17 17.1,36.17 C1.1 | 36.75,35.95 36.75,34.23 J13.2 | 36.75,35.95 36.75,36.17 41.5,40.92 42.58,40.92 C17.1 | 36.75,35.95 33.51,35.95 | 33.51,35.95 33.29,35.95 31.13,33.79 J12.2
  Bottom 0.203: v34.37,21.7 35.02,21.7 36.96,23.65 | 36.96,23.65 41.93,28.61 U$17.GND | 36.96,23.65 v39.77,20.84 39.9,18.47 46.81,11.56 | DR2.P$2 49.27,22.78 49.27,24.08 44.74,28.61 U$17.GND' | 46.81,11.56 46.68,8.1 42.79,4.21 J18.2 42.58,4.21 40.63,6.16 25.52,6.16 23.58,4.21 J19.2 23.36,4.21 22.93,4.21 20.34,6.81 18.18,6.81 13.21,11.77 9.98,11.77 | 74.96,9.61 74.96,7.24 77.98,4.21 J16.2 78.2,4.21 78.85,4.21 81.87,7.24 89.43,7.24 90.94,8.75 90.94,9.83 89.21,11.56 89.21,11.99 J11.2 | 74.96,9.61 v74.96,12.85 | J17.2 59.2,4.21 58.98,4.43 v58.98,7.45 60.28,8.75 60.28,9.61 | 56.83,16.3 58.12,17.6 61.58,17.6 63.52,15.66 v65.68,15.66 71.29,21.27 v76.04,21.27 | 56.83,16.3 56.83,15.66 60.28,12.2 60.28,9.61 | 56.83,16.3 55.96,17.17 v54.81,17.67 55.1,17.38 52.51,17.38 46.81,11.56 | 60.28,9.61 74.96,9.61 | 9.98,31.2 8.9,31.2 6.3,33.79 | 9.98,31.2 v10.62,31.2 11.92,32.5 v11.92,33.58 | 6.3,33.79 4.15,35.95 J21.2 | 9.98,31.2 v9.98,28.83 9.98,11.77 | 6.3,33.79 6.52,33.79 v9.76,37.03 10.19,37.03 12.35,34.87 17.32,34.87 17.75,34.44 18.18,34.44 19.48,35.74 19.48,41.57 -.P$2 | J20.2 4.15,9.4 6.3,11.56 v9.76,11.56 9.98,11.77 | J15.12 58.77,48.69 59.85,49.77 59.85,49.99 60.71,50.85 66.54,50.85 68.7,48.69 J15.16 68.7,48.48 68.7,37.25 64.17,32.71 U1.8 63.95,32.71 63.3,32.71 57.47,38.54 55.53,38.54 54.02,40.05 U1.13 53.8,40.05 53.16,40.05 49.7,36.6 42.36,36.6 J14.2 42.14,36.6 41.71,36.6 39.77,38.54 39.12,38.54 36.75,36.17 36.75,34.23 J13.2 | -.P$3 24.66,41.57 24.66,40.05 30.92,33.79 J12.2
  pour Top: 1,5 arc90 5,1 89,1 arc90 93,5 93,47 arc90 88,52 5,52 arc90 1,47
N$1
  Top 0.203: CG7.1 86.19,11.99 86.62,11.99 87.7,10.91 90.29,10.91 90.94,11.56 90.94,12.64 90.08,13.5 89.21,13.5 88.56,14.15 88.56,18.68 R23.2
N$2
  Top 0.203: R8.1 77.34,36.82 80.14,36.82 80.36,37.03 CG8.5
N$3
  Top 0.203: LED7.C 90.08,16.74 90.08,18.68 R23.1
N$4
  Top 0.203: CG7.5 83.6,11.99 83.6,9.4 84.03,8.96 84.03,8.32 R7.1
N$5
  Top 0.203: CG6.5 78.42,13.28 76.69,13.28 74.1,15.87 R6.1
N$6
  Top 0.203: R24.2 87.92,31.2 87.92,32.28 83.17,37.03 CG8.1
N$7
  Top 0.203: CG5.5 46.03,8.53 46.03,7.45 45.38,6.81 45.38,5.3 46.68,4 47.11,4 47.97,3.14 R5.1
N$8
  Top 0.203: CG4.5 38.91,10.69 39.55,11.34 39.55,11.56 40.42,12.42 41.5,12.42 42.36,13.28 R4.1
N$9
  Top 0.203: LED8.C 89.86,28.83 89.86,30.99 R24.1
N$10
  Top 0.203: CG3.5 13,11.56 13,12.2 15.16,14.36 R3.1
N$11
  Top 0.203: CG2.5 12.35,17.38 12.35,21.05 14.08,22.78 R2.1
N$12
  Top 0.203: LED6.C 70.64,3.78 70.64,5.3 71.08,5.73 R26.1
N$13
  Top 0.203: CG1.5 13.65,37.9 14.73,36.82 14.73,33.79 R1.1
N$14
  Top 0.203: R26.2 73.23,5.94 73.88,5.94 78.42,10.48 CG6.1
N$15
  Top 0.203: R16.2 36.96,7.45 38.26,7.45 38.69,7.89 CG4.1
N$16
  Top 0.203: R16.1 36.75,5.51 36.75,3.14 LED4.C
N$17
  Top 0.203: LED5.C 53.37,3.14 53.37,4.65 53.8,5.08 R21.1
N$18
  Top 0.203: CG5.1 46.25,6.16 46.25,6.81 46.68,7.24 53.59,7.24 53.8,7.02 R21.2
N$19
  Top 0.203: LED3.C 17.32,3.14 17.32,5.3 R15.1
N$20  (via drill 0.33)
  Top 0.203: v12.13,7.89 12.13,8.1 12.78,8.75 CG3.1 | v16.02,7.89 16.67,7.89 17.1,7.45 R15.2
  Bottom 0.203: v16.02,7.89 v12.13,7.89
N$21
  Top 0.203: LED1.C 3.28,33.15 5.01,33.15 R13.1
N$22
  Top 0.203: R13.2 6.95,33.36 6.95,37.68 8.03,38.76 10.19,38.76 10.84,38.11 CG1.1
N$23
  Top 0.203: R10.2 8.25,16.09 8.68,16.52 8.68,16.74 9.11,17.17 9.54,17.17 CG2.1
N$24
  Top 0.203: R10.1 6.09,16.09 4.36,16.09 3.93,16.52 LED2.C
N$28
  Top 0.203: TM1.2 73.45,43.08 69.13,43.08 63.73,48.48 J15.14
N$36  (via drill 0.33)
  Top 0.203: v10.84,30.12 10.62,30.34 9.76,30.34 U$23.1 | v19.26,27.75 23.58,27.75 24.66,28.83 24.66,29.26 R38.1 24.87,29.48 26.38,29.48 29.41,32.5 29.41,34.87 32.43,37.9 U$29.2
  Bottom 0.203: v10.84,30.12 16.88,30.12 v19.26,27.75
N$37  (via drill 0.33)
  Top 0.203: v9.33,32.71 9.54,32.5 9.54,31.85 U$23.3 | v21.2,26.88 20.34,26.02 R9.2 20.12,26.02 19.26,25.16 19.26,22.78 17.96,21.49 U$28.2
  Bottom 0.203: v9.33,32.71 9.98,32.71 11.7,34.44 13.65,34.44 v21.2,26.88
N$38
  Top 0.203: R9.1 18.4,26.24 18.4,28.83 C21.1 18.61,29.04 20.12,30.55 20.12,31.63 R36.2
N$39  (via drill 0.33)
  Top 0.203: U$2.4 7.6,20.19 8.68,21.27 10.19,21.27 11.05,20.41 11.49,20.41 R11.2 11.7,20.41 v11.7,21.49 | R36.1 18.4,31.63 17.53,30.77 17.53,25.37 17.75,25.16 17.75,23.21 U$26.1 17.75,23 v16.88,22.13
  Bottom 0.203: v11.7,21.49 16.24,21.49 v16.88,22.13
N$40
  Top 0.203: U$23.4 7.82,31.85 6.95,31.85 6.09,30.99 6.09,30.55 7.38,29.26 7.6,29.26 8.03,28.83 8.03,26.88 11.49,23.43 R12.2 11.49,23.21 10.62,22.35 6.52,22.35 5.01,20.84 5.01,20.19 U$2.2
N$41  (via drill 0.33)
  Top 0.203: 11.49,29.69 11.7,29.91 11.7,30.99 U$1.4 | 11.49,29.69 11.05,29.26 10.62,29.26 10.19,29.69 9.11,29.69 8.47,30.34 8.03,30.34 U$23.6 | v16.67,29.26 16.88,29.48 16.88,34.23 R17.1 | 11.49,29.69 v11.92,29.26
  Bottom 0.203: v11.92,29.26 v16.67,29.26
N$42
  Top 0.203: R38.2 23.15,29.48 23.15,31.63 C23.1 23.15,31.85 24.44,33.15 24.44,34.23 R37.1
N$43
  Top 0.203: U$27.1 32.21,40.05 28.54,40.05 22.93,34.44 R37.2 22.71,34.44 20.12,37.03 16.45,37.03 16.24,37.25 | 16.24,37.25 14.94,38.54 12.78,38.54 12.57,38.33 12.57,36.17 11.05,34.66 11.05,34.23 R14.2 | 16.24,37.25 15.8,36.82 15.8,35.74 16.24,35.3 16.24,29.91 15.8,29.48 15.16,29.48 14.29,30.34 14.29,30.99 U$1.2
N$44  (via drill 0.33)
  Top 0.203: v30.27,7.45 29.41,7.45 U$12.3 | 29.41,20.62 29.62,20.62 29.84,20.41 R31.2 | 29.41,20.62 v28.76,20.62 | 29.41,20.62 30.92,22.13 U$16.2
  Bottom 0.203: v30.27,7.45 27.9,7.45 27.68,7.24 18.4,7.24 13.86,11.77 13.86,17.38 17.1,20.62 v28.76,20.62
N$45
  Top 0.203: 29.62,18.25 29.84,18.25 R31.1 29.62,18.25 | 29.62,18.25 26.6,18.25 R32.2 | 29.62,18.25 29.62,16.09 C27.1
N$46  (via drill 0.33)
  Top 0.203: 27.46,20.84 26.6,19.98 R32.1 | 27.46,20.84 28.76,22.13 U$15.1 | U$4.4 31.35,8.96 32.43,7.89 32.43,6.81 R40.2 32.65,6.59 33.51,5.73 34.8,5.73 35.24,6.16 35.24,8.32 v32.86,10.69 | 27.46,20.84 28.98,19.33 30.49,19.33 v32.86,16.95
  Bottom 0.203: v32.86,10.69 v32.86,16.95
N$47
  Top 0.203: 29.84,10.91 30.49,11.56 31.13,11.56 U$4.2 | 29.84,10.91 29.41,10.48 29.41,9.4 U$12.4 | 29.84,10.91 28.76,11.99 28.33,11.99 R35.2
N$50  (via drill 0.33)
  Top 0.203: v27.25,8.53 27.25,8.32 27.9,7.67 U$12.1 | v26.38,13.5 25.52,14.36 R34.1 25.74,14.58 26.6,15.44 26.6,16.95 26.38,17.17 25.95,17.17 25.09,18.03 24.01,18.03 U$19.2
  Bottom 0.203: v27.25,8.53 26.38,9.4 v26.38,13.5
N$51  (via drill 0.33)
  Top 0.203: v27.68,10.91 28.11,10.48 28.11,9.4 U$12.6 | v27.25,12.85 26.82,12.85 26.6,12.64 v25.52,12.64 | U$3.4 20.55,8.1 21.42,8.1 v22.23,8.37 24.44,6.37 26.17,6.37 28.33,4.21 28.33,3.78 R39.1
  Bottom 0.203: v27.68,10.91 27.68,12.42 v27.25,12.85 | v25.52,12.64 25.52,10.91 22.52,8.37 v22.23,8.37
N$52  (via drill 0.33)
  Top 0.203: U$18.1 21.63,17.82 20.34,16.52 R33.2 20.12,16.3 v19.26,15.44 | v18.4,8.96 18.4,6.81 17.96,6.37 16.67,6.37 15.37,5.08 12.35,5.08 11.05,6.37 9.54,6.37 R41.2 | v22.07,11.99 22.07,11.34 21.2,10.48 20.55,10.48 U$3.2
  Bottom 0.203: v18.4,8.96 17.96,9.4 17.96,11.99 | 17.96,11.99 17.96,14.15 v19.26,15.44 | 17.96,11.99 v22.07,11.99
N$54
  Top 0.203: R33.1 20.34,14.58 20.99,14.58 22.71,16.3 C29.1 22.93,16.3 25.52,16.3 R34.2
N$55
  Top 0.203: U$31.3 61.79,10.69 62.44,10.69 63.52,11.77 64.81,11.77 66.11,13.07 66.11,13.5 66.97,14.36 R42.2 67.19,14.36 67.41,14.15 70,14.15 70.43,14.58 70.43,15.66 70.21,15.87 67.84,15.87 66.54,17.17 66.54,18.25 67.19,18.9 67.19,19.76 U$35.2
N$56
  Top 0.203: R42.1 67.19,12.85 69.13,12.85 69.35,13.07 C30.1 69.56,13.28 71.72,13.28 R43.2
N$57
  Top 0.203: U$34.1 70.86,19.76 70.86,18.9 71.72,18.03 71.72,15.23 R43.1 71.94,15.01 73.88,13.07 73.88,11.99 R48.2 73.88,11.77 73.23,11.12 70,11.12 U$6.4
N$58  (via drill 0.33)
  Top 0.203: v61.79,13.07 61.79,12.2 U$31.4 | v67.41,10.48 69.13,8.75 69.78,8.75 U$6.2 70,8.75 70.21,8.96 72.37,8.96 R46.2
  Bottom 0.203: v61.79,13.07 64.81,13.07 v67.41,10.48
N$59  (via drill 0.33)
  Top 0.203: U$31.1 60.5,10.69 60.5,11.12 60.71,11.34 62.44,11.34 63.3,12.2 63.52,12.2 64.6,13.28 R45.1 64.6,13.5 63.73,14.36 v63.73,14.79 | v61.14,16.74 61.14,17.6 U$37.2
  Bottom 0.203: v61.14,16.74 61.79,16.74 v63.73,14.79
N$60  (via drill 0.33)
  Top 0.203: v59.42,11.99 60.28,11.99 U$31.6 | U$5.4 52.72,8.53 53.16,8.96 v54.23,8.96 55.31,7.89 55.31,2.92 56.18,2.06 59.63,2.06 63.09,5.51 R47.1
  Bottom 0.203: v59.42,11.99 56.39,8.96 v54.23,8.96
N$61  (via drill 0.33)
  Top 0.203: v50.78,4.21 49.27,5.73 R49.2 | v63.95,19.33 63.09,18.47 R44.2 62.87,18.25 62.87,17.38 60.93,15.44 U$36.1 60.71,15.23 59.63,14.15 57.69,14.15 54.67,11.12 52.72,11.12 U$5.2
  Bottom 0.203: v50.78,4.21 54.02,4.21 56.61,1.62 89.43,1.62 91.8,4 91.8,29.26 87.05,34.01 87.05,37.9 87.48,38.33 87.48,38.76 86.84,39.41 82.95,39.41 76.47,32.93 73.02,32.93 72.37,32.28 72.37,31.42 74.53,29.26 74.53,25.37 68.48,19.33 v63.95,19.33
N$62
  Top 0.203: R45.2 62.87,13.5 62.87,15.66 C32.1 63.09,15.87 64.6,17.38 64.6,18.25 R44.1
N$63  (via drill 0.33)
  Top 0.203: v81.44,23.86 81.66,24.08 81.66,24.94 U$40.3 | v73.23,32.07 73.23,32.5 72.8,32.93 U$44.2 72.8,33.15 73.23,33.58 73.23,36.17 R50.2
  Bottom 0.203: v73.23,32.07 v81.44,23.86
N$64
  Top 0.203: R51.2 76.69,29.48 76.69,33.15 C33.1 76.47,33.36 75.18,34.66 75.18,36.17 R50.1
N$65  (via drill 0.33)
  Top 0.203: 74.75,29.48 73.67,30.55 73.02,30.55 U$43.1 | v84.46,38.33 84.89,37.9 85.54,37.9 R56.2 | 74.75,29.48 v75.83,30.55 | 74.75,29.48 R51.1
  Bottom 0.203: v84.46,38.33 83.6,38.33 v75.83,30.55
N$66
  Top 0.203: U$40.4 81.87,26.67 83.38,26.67 84.68,27.96 86.19,27.96 86.4,28.18 86.4,30.34 85.76,30.99 R54.2 85.54,31.2 85.11,31.63 81.66,31.63 80.58,30.55 80.58,29.69 U$8.2
N$67
  Top 0.203: U$40.1 80.36,24.94 78.85,24.94 78.63,24.73 77.55,24.73 76.47,25.8 R53.1 76.26,25.8 75.39,24.94 73.45,24.94 U$46.2
N$68
  Top 0.203: 83.38,25.8 85.33,25.8 85.54,25.59 R55.1 | 83.38,25.8 80.79,25.8 80.36,26.24 80.36,26.45 U$40.6 | 83.38,25.8 83.38,20.84 82.73,20.19 82.73,17.17 U$7.4
N$69  (via drill 0.33)
  Top 0.203: U$45.1 71.29,24.94 71.29,23.86 74.31,20.84 74.31,19.98 R52.2 74.53,19.76 75.39,18.9 v81.87,18.9 | 83.81,17.38 83.38,16.95 83.38,15.66 83.17,15.44 81.01,15.44 80.36,16.09 80.36,16.95 U$7.2 | 83.81,17.38 84.89,18.47 84.89,19.11 R57.2 | 83.81,17.38 v83.6,17.6
  Bottom 0.203: v81.87,18.9 82.3,18.9 v83.6,17.6
N$70
  Top 0.203: R52.1 76.04,19.98 74.53,21.49 74.53,22.35 C35.1 74.31,22.57 72.37,24.51 72.37,27.53 73.02,28.18 73.67,28.18 74.1,27.75 76.26,27.75 77.98,26.02 R53.2
RD1  (via drill 0.33)
  Top 0.203: LS1.1 77.77,47.83 v79.64,47.83 81.22,47.83 LS2.1
  Bottom 0.203: v79.64,47.83 84.46,47.83 85.33,48.69 89.21,48.69 89.86,48.04 89.86,41.78 89,40.92 87.48,40.92 86.19,42.21 J9.5
RD2
  Top 0.203: LS1.3 77.77,44.8 81.22,44.8 LS2.3 81.44,44.8 85.33,40.92 87.05,40.92 88.35,42.21 J9.6
RDRAIN
  Top 0.203: U10.7 51,17.17 51.64,17.17 52.94,15.87 53.37,15.87 R18.1 53.59,15.66 54.88,15.66 55.96,14.58 59.2,14.58 59.85,15.23 59.85,17.82 64.6,22.57 70,22.57 DR2.P$1
REL1  (via drill 0.33)
  Top 0.203: U$29.1 34.59,38.11 34.59,40.05 U$27.2 34.59,40.27 v39.77,40.27
  Bottom 0.203: v39.77,40.27 44.09,40.27 45.81,38.54 47.11,38.54 48.62,40.05 U1.15
REL2  (via drill 0.33)
  Top 0.203: U$28.1 20.12,21.49 20.12,23 U$26.2 20.34,23.21 v24.01,23.21 | v41.06,30.55 41.5,30.55 41.93,30.99 44.74,30.99 46.25,32.5 U1.1
  Bottom 0.203: v24.01,23.21 31.57,30.77 40.85,30.77 v41.06,30.55
REL3
  Top 0.203: U$18.2 21.85,20.19 23.79,20.19 U$19.1 24.01,20.41 24.01,20.84 30.05,26.88 45.17,26.88 45.81,27.53 45.81,29.91 48.62,32.71 U1.2
REL4
  Top 0.203: U$15.2 28.98,24.51 30.92,24.51 U$16.1 31.13,24.51 45.38,24.51 48.41,27.53 48.41,29.91 51.21,32.71 U1.3
REL5
  Top 0.203: U$36.2 58.77,15.44 58.77,17.6 U$37.1 58.77,17.82 58.77,24.94 55.96,27.75 55.96,30.55 54.02,32.5 U1.4
REL6
  Top 0.203: 70,17.6 67.41,17.6 U$35.1 | 70,17.6 70.64,17.6 U$34.2 | 70,17.6 70,20.84 71.29,22.13 71.29,23.21 66.11,28.4 66.11,29.91 65.03,30.99 58.12,30.99 56.61,32.5 U1.5
REL7  (via drill 0.33)
  Top 0.203: v68.48,27.1 71.08,27.1 U$45.2 | v73.23,26.02 73.23,27.1 U$46.1
  Bottom 0.203: U1.6 58.98,32.5 60.93,30.55 60.93,27.75 61.79,26.88 65.46,26.88 65.68,27.1 v68.48,27.1 69.56,26.02 v73.23,26.02
REL8  (via drill 0.33)
  Top 0.203: U$43.2 70.64,30.77 70.64,32.93 U$44.1 70.43,33.15 v68.92,33.15 | v67.84,34.23 63.09,34.23 61.58,32.71 U1.7
  Bottom 0.203: v67.84,34.23 v68.92,33.15
RLATCH
  Top 0.203: U$17.12 34.59,43.94 36.53,42 54.02,42 55.75,40.27 56.39,40.27 U1.12 56.61,40.27 58.45,42.01 60.75,42.04 61.1,42.48 61.1,45.68 62.42,47.81 62.42,49.75 63.52,50.85 87.05,50.85 89.86,48.04 89.86,46.75 88.56,45.45 88.56,45.02 J9.4
RSER  (via drill 0.33)
  Top 0.203: v75.61,46.53 77.55,46.53 LS1.2
  Bottom 0.203: v75.61,46.53 73.23,46.53 68.48,51.28 43.66,51.28 41.93,49.55 41.93,46.53 39.55,44.16 U$17.10 39.34,44.16 37.61,45.88 36.53,45.88 35.67,45.02 35.67,42.86 39.12,39.41 41.71,39.41 43.01,38.11 48.84,38.11 50.78,40.05 51.21,40.05 U1.14
RSEROUT
  Top 0.203: LS2.2 81.44,46.53 82.09,47.18 82.09,48.69 81.87,48.91 76.91,48.91 74.75,46.75 74.75,44.59 75.18,44.16 75.18,42 73.88,40.7 64.6,40.7 64.17,40.27 U1.9
SCL  (via drill 0.33)
  Top 0.203: 37.4,21.92 35.88,21.92 CS0.SCL | v41.28,21.92 42.14,21.92 42.36,22.13 CS1.SCL | v44.05,15.24 45.6,14.58 U10.4 | v60.63,23.43 64.81,28.61 U$17.A5 | v78.2,35.74 78.2,35.52 78.42,35.3 78.42,29.48 77.12,28.18 74.31,28.18 73.88,28.61 v66.97,28.61
  Top 0.254: 37.4,21.92 38.22,21.17 38.22,20.08 39.59,18.66 v40.77,18.64
  Bottom 0.203: v41.28,21.92 40.85,21.49 v40.77,18.64 43.87,15.44 | 43.87,15.44 v44.05,15.24 | v60.63,23.43 52.51,23.43 48.84,19.76 48.19,19.76 43.87,15.44 | v78.2,35.74 78.2,36.38 85.97,44.16 85.97,44.8 J9.3 | v66.97,28.61 65.03,28.61 U$17.A5
SDA  (via drill 0.33)
  Top 0.203: CS0.SDA 37.4,20.41 37.4,20.36 39.81,15.91 45.62,15.94 U10.3 45.81,16.09 46.46,16.09 47.33,16.95 47.33,18.9 | 47.33,18.9 45.6,20.62 44.09,20.62 CS1.SDA | v48.41,18.9 47.33,18.9
  Bottom 0.203: 70.86,32.28 71.08,32.28 85.97,47.18 J9.1 | 70.86,32.28 65.89,32.28 62.44,28.83 U$17.A4 | v48.41,18.9 62.44,18.9 68.7,25.16 73.45,25.16 74.1,25.8 74.1,29.04 70.86,32.28
SRCLK
  Top 0.203: J9.2 88.35,47.4 87.92,47.4 85.97,49.34 76.69,49.34 74.31,46.96 74.31,44.37 74.75,43.94 74.75,42.21 74.31,41.78 61.3,41.78 58.98,40.27 U1.11
  Bottom 0.203: U1.11 58.77,40.27 58.34,40.27 56.61,42 38.91,42 36.96,43.94 U$17.11
VBAT1  (via drill 0.33)
  Top 0.203: U$1.3 13,30.99 13,27.75 14.08,26.67 14.08,26.02 U$1.7 14.29,25.8 15.37,25.8 U$1.8 15.59,26.02 v16.67,26.02 | v17.96,35.3 18.83,34.44 R17.2
  Bottom 0.203: v17.96,35.3 16.24,35.3 13.43,38.11 | 13.43,38.11 12.78,38.76 4.15,38.76 J21.1 | v16.67,26.02 21.42,26.02 22.07,26.67 22.07,41.57 20.12,43.51 18.83,43.51 13.43,38.11
VBAT2
  Top 0.203: R12.1 9.76,23.43 9.33,23.43 7.6,25.16 U$2.5 7.38,25.37 6.3,25.37 U$2.6 6.09,25.16 6.09,24.51 3.71,22.13 3.71,20.19 U$2.1 3.5,19.98 2.85,19.33 2.85,13.71 3.93,12.64 3.93,11.99 J20.1
VBAT3  (via drill 0.33)
  Top 0.203: U$3.8 25.74,11.56 25.74,10.48 U$3.7 25.52,10.26 v23.79,10.26 | R39.2 26.6,3.57 25.3,3.57 23.79,2.06 22.71,2.06 20.77,4 J19.1 20.55,4.21 18.83,5.94 18.83,8.32 19.69,9.18 20.34,9.18 U$3.3 20.55,9.4 20.99,9.83 v22.07,9.83
  Bottom 0.203: v23.79,10.26 22.5,10.26 v22.07,9.83
VBAT4
  Top 0.203: R35.1 28.33,13.71 30.49,13.71 31.13,13.07 U$4.1 31.35,12.85 32,12.85 34.37,10.48 36.32,10.48 U$4.6 36.53,10.26 36.53,9.18 U$4.5 36.32,8.96 35.67,8.32 35.67,6.81 35.88,6.59 37.4,6.59 39.77,4.21 J18.1
VBAT5
  Top 0.203: 58.34,5.94 56.61,4.21 J17.1 | 58.34,5.94 58.55,6.16 59.63,6.16 60.06,5.73 61.36,5.73 R47.2 | 54.45,9.83 54.88,9.83 55.96,10.91 57.69,10.91 U$5.7 57.91,11.12 57.91,12.2 U$5.8 | 54.45,9.83 52.72,9.83 U$5.3 | 54.45,9.83 58.34,5.94
VBAT6
  Top 0.203: U$6.5 64.81,10.91 64.81,9.83 U$6.6 64.81,9.61 66.97,9.61 69.13,7.45 69.78,7.45 U$6.1 70,7.45 72.16,7.45 | 72.16,7.45 72.8,7.45 74.31,8.96 R46.1 | 72.16,7.45 72.16,5.08 73.02,4.21 75.18,4.21 J16.1
VBAT7  (via drill 0.33)
  Top 0.203: U$7.8 79.06,22.13 80.14,22.13 U$7.7 80.36,22.13 v80.36,19.76 | R55.2 85.76,23.43 87.05,23.43 91.37,19.11 91.37,11.34 89.21,9.18 J11.1 89,9.4 87.27,9.4 85.11,11.56 85.11,11.99 84.25,12.85 82.3,12.85 80.79,14.36 79.5,14.36 78.2,15.66 78.2,18.25 78.42,18.47 80.58,18.47 81.22,17.82 81.22,17.17 U$7.3
  Bottom 0.203: v80.36,19.76 80.36,18.03 89,9.4 J11.1
VBAT8
  Top 0.203: U$8.1 79.28,29.69 79.28,30.77 81.66,33.15 81.66,34.66 U$8.6 81.87,34.87 82.95,34.87 U$8.5 83.17,34.66 84.89,32.93 85.54,32.93 R54.1 85.76,32.71 86.62,31.85 86.62,31.2 87.7,30.12 88.56,30.12 89,30.55 89,34.23 J10.1
VCC  (via drill 0.33, 0.6)  (4 unrouted)
  Top 0.2: J15.2 33.17,47.87 27.9,42.6 27.9,40.5 25.3,37.9 17.07,37.9 C1.2
  Top 0.203: U10.5 50.78,14.58 49.49,13.28 49.49,12.85 C18.2 49.27,12.64 49.27,11.99 46.89,9.61 | 42.79,14.79 43.22,14.79 44.52,13.5 44.52,11.34 C7.2 | 35.88,18.9 CS0.VCC 35.67,19.11 34.16,19.11 33.29,19.98 33.29,21.7 34.59,23 36.96,23 38.69,21.27 | 38.69,21.27 38.69,20.84 40.2,19.33 42.36,19.33 CS1.VCC | CG4.4 40.85,10.48 41.93,10.48 42.36,10.04 43.44,10.04 44.52,11.12 C7.2 | 46.89,9.61 46.03,10.48 45.38,10.48 44.74,11.12 C7.2 | 46.89,9.61 47.76,8.75 CG5.4 | U$40.5 81.01,26.67 81.01,27.1 v81.66,27.75 82.09,28.18 84.25,28.18 84.89,28.83 85.33,28.83 C34.2 | v60.28,13.5 61.14,12.64 61.14,12.2 U$31.5 | v57.69,16.09 56.39,17.38 C9.2 56.39,17.6 54.23,19.76 53.37,19.76 | v82.3,13.93 83.38,13.93 CG7.4 | 38.69,21.27 39.12,21.27 41.06,23.21 47.11,23.21 50.56,19.76 53.37,19.76 | CG8.4 80.36,39.19 80.36,39.62 79.28,40.7 C15.2 79.06,40.7 76.91,38.54 73.67,38.54 72.59,39.62 TM1.1 72.37,39.62 65.46,39.62 64.38,38.54 63.09,38.54 61.58,40.05 U1.10 61.36,40.05 60.93,40.05 59.42,38.54 52.72,38.54 | C24.1 71.94,49.12 70.64,49.12 69.35,50.42 67.84,50.42 66.33,48.91 J15.15 | v28.76,10.91 28.76,9.4 U$12.5 | v18.83,9.83 18.4,10.26 17.53,10.26 C5.2 | U$17.5V 39.55,28.83 39.77,29.04 39.77,32.07 C20.1 39.99,32.28 40.63,32.93 40.63,37.25 42.58,39.19 C17.2 42.79,39.41 45.6,39.41 46.25,40.05 U1.16 46.46,40.05 47.97,38.54 52.72,38.54 | 53.37,19.76 53.37,30.99 52.72,31.63 52.72,38.54 | +.P$4 14.08,48.69 9.33,48.69 +.P$1 9.11,48.48 9.11,41.57 +.P$2 | C1.2 16.88,38.11 16.88,38.76 14.29,41.35 +.P$3 14.08,41.57 9.33,41.57 +.P$2 | 3.71,30.34 3.28,30.77 LED1.A 3.71,30.34 | 3.71,30.34 5.23,28.83
  Top 0.203: 5.23,28.83 5.66,28.4 6.95,28.4 C22.2 | v6.95,30.77 7.38,31.2 7.82,31.2 U$23.5 | v13.43,37.03 13.43,36.17 CG1.4 | 3.71,30.34 6.09,32.71 6.09,38.33 9.11,41.35 +.P$2 | 89.21,19.54 89.21,18.03 89,17.82 89,15.87 89.86,15.01 89.86,14.58 LED7.A | 89.21,19.54 85.97,22.78 84.89,22.78 84.46,23.21 84.46,24.08 84.89,24.51 87.7,24.51 89.64,26.45 LED8.A | C11.2 76.47,17.38 75.61,16.52 75.61,15.01 76.47,14.15 v76.91,14.15 79.06,14.15 79.93,13.28 80.36,13.28 CG6.4 80.58,13.07 80.58,13.02 83.08,9.91 83.38,7.24 84.89,5.73 C13.2 | 85.11,5.73 C13.2 | 9.76,10.48 7.38,12.85 | 7.38,12.85 5.66,14.58 3.93,14.58 LED2.A | 12.13,10.48 13.86,10.48 14.73,11.34 CG3.4 | 12.13,10.48 9.76,10.48 | 12.13,10.48 12.13,15.23 CG2.4 12.35,15.44 13.86,16.95 13.86,19.33 C3.2 | C31.2 61.79,7.89 62.22,7.89 63.52,6.59 65.68,6.59 68.48,3.78 LED6.A 68.7,3.57 70.21,2.06 81.44,2.06 84.89,5.51 C13.2 | LED5.A 49.68,1.92 v49.75,2 | 9.76,10.48 9.76,10.04 8.47,8.75 8.47,5.73 11.05,3.14 15.16,3.14 LED3.A 15.37,2.92 16.67,1.62 28.54,1.62 31.57,4.65 C28.2 31.78,4.65 33.29,3.14 34.59,3.14 LED4.A 34.8,2.92 34.75,3 | 5.23,28.83 2.2,25.8 2.2,11.56 3.07,10.69 5.23,10.69 7.38,12.85 | 35,2.75 34.75,3 | 34.75,3 v33.25,2 | 89.21,19.54 v87.75,21
  Top 0.254: 35.88,18.9 35.88,16.7 36.06,16.5 38.37,16.5 40.1,14.79 42.79,14.79
  Bottom 0.203: v57.69,16.09 v60.28,13.5 60.71,13.93 76.91,13.93 | 76.91,13.93 79.5,13.93 | 79.5,13.93 v82.3,13.93 | v81.66,27.75 81.66,24.73 82.3,24.08 82.3,22.78 79.5,19.98 79.5,13.93 | U1.10 61.58,40.27 61.58,40.7 63.73,42.86 63.73,46.32 66.11,48.69 J15.15 | 28.76,14.36 28.76,18.03 39.34,28.61 U$17.5V | 28.76,14.36 v28.76,10.91 | v18.83,9.83 20.99,9.83 25.52,14.36 28.76,14.36 | v6.95,30.77 1.99,35.74 1.99,37.68 | 1.99,37.68 1.99,39.19 4.15,41.35 9.11,41.35 +.P$2 | v13.43,37.03 10.84,37.03 9.98,37.9 5.44,37.9 5.23,37.68 1.99,37.68 | v76.91,14.15 76.91,13.93
  other vias: 82.5,10.5
  pour Bottom: 1,5 arc90 5,1 89,1 arc90 93,5 93,47 arc90 88,52 5,52 arc90 1,47

### Text on the board
_bsilk: ACT Charger | usc-actlab.github.io | Rev. E | Vin: 5V. Chg: 500mA. Dischg: <= 512mA.